# Altium project SC944D.PrjPCB (part 4 of 4)

## Sheet SDEC944-xD_Fil_Pilote_1-2_(commun).SchDoc: Fil Pilote (1/2)
size 393 x 270 mm; CompanyName: Seccom; Address1: 521, rue du capt. François Garbit; Address2: 69440 Mornant; Address3: seccom@seccom.fr; Address4: www.seccom.fr; DocumentNumber: 14; SheetNumber: 14; SheetTotal: 22; PageSetup: Record=PageOptions|CenterHorizontal=True|CenterVertical=True|PrintScale=0.72|XCorrection=1.00|YCorrection=1.00|PrintKind=0|BorderSize=5000000|LeftOffset=0|BottomOffset=0|Orientation=2|PaperLength=1000|PaperWidth=1000|Scale=100|PaperSource=7|PrintQuality=-4|MediaType=1|DitherType=10|PaperKind=A4|PrintScaleMode=1
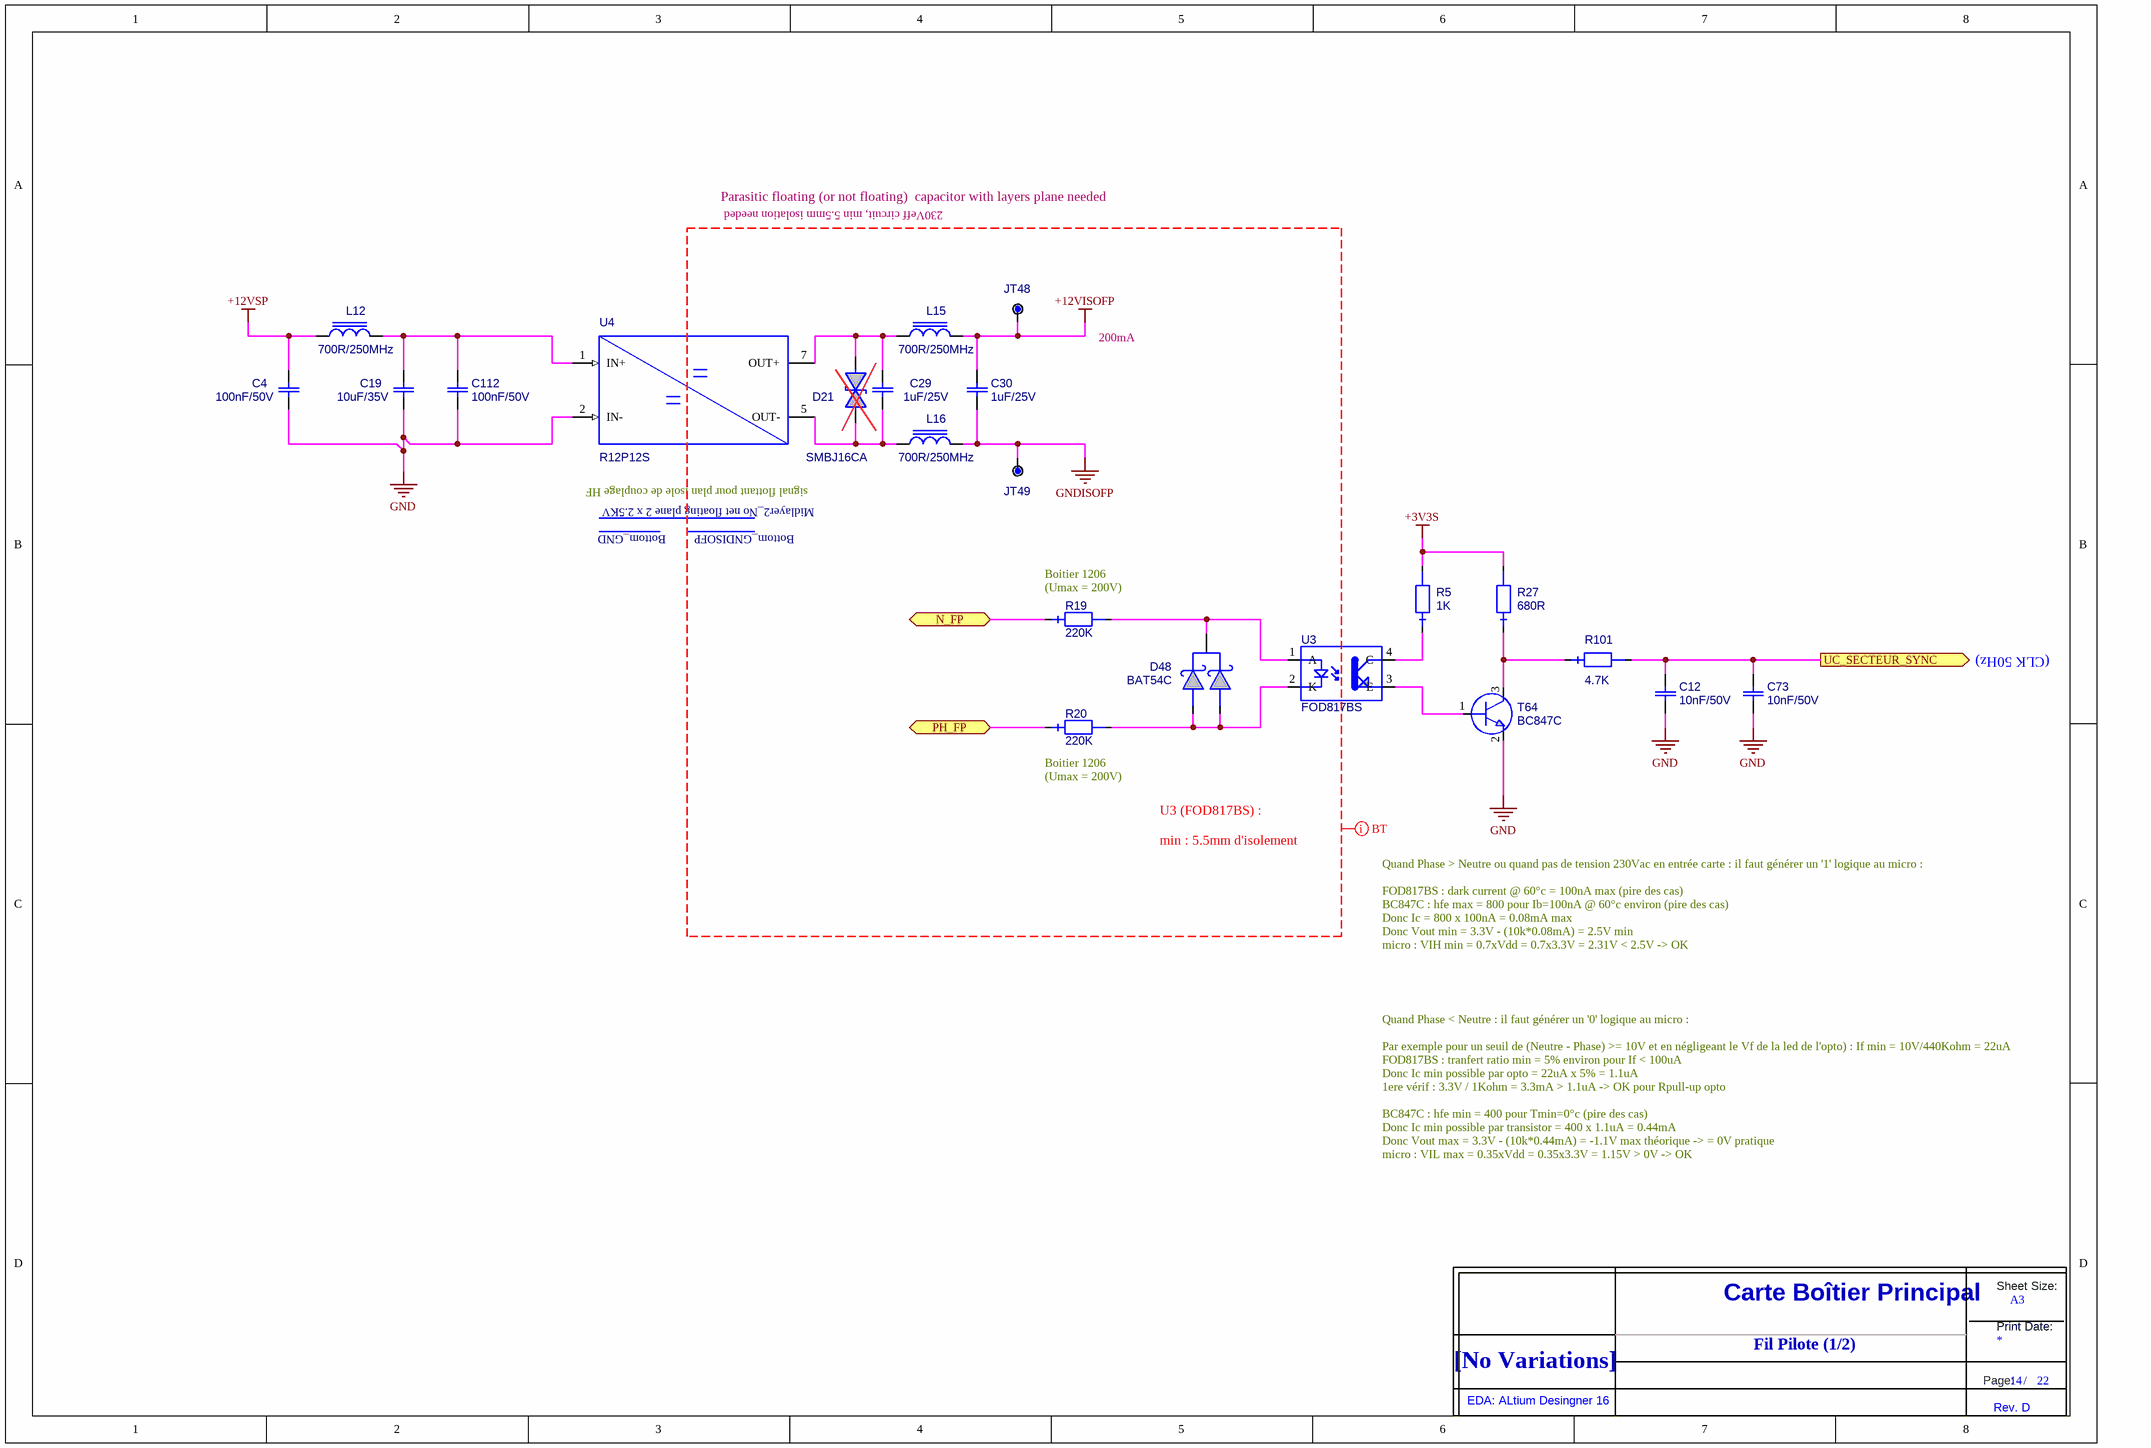
[diagram p8: SDEC944-xD_Fil_Pilote_1-2_(commun).SchDoc]

### Parts
(Parts that share a designator on the sheet are numbered #1, #2 ... from top to bottom, then left to right.)
C4  value 100nF/50V  [0603_ReflowSoldering_CAP]  (hidden comment: C_0603_X7R_10%_100N-50V)
C12  value 10nF/50V  [0603_ReflowSoldering_CAP]  (hidden comment: C_0603_X7R_10%_10N-50V)
C19  value 10uF/35V  [1210_ReflowSoldering_CAP]  (hidden comment: C_1210_X5R_10%_10U-35V)
C29  value 1uF/25V  [0805_ReflowSoldering_CAP]  (hidden comment: C_0805_X5R_10%_1U-25V)
C30  value 1uF/25V  [0805_ReflowSoldering_CAP]  (hidden comment: C_0805_X5R_10%_1U-25V)
C73  value 10nF/50V  [0603_ReflowSoldering_CAP]  (hidden comment: C_0603_X7R_10%_10N-50V)
C112  value 100nF/50V  [0603_ReflowSoldering_CAP]  (hidden comment: C_0603_X7R_10%_100N-50V)
D21  SMBJ16CA  [DO214AA-SMB-NP_ReflowSoldering]  (no BOM)
D48  BAT54C  [SOT23_3L_ReflowSoldering]
JT48  POINT_TEST_PAD_40MIL  [PAD_CL5_E40X40Y17D]  (value not drawn)  (no BOM)
JT49  POINT_TEST_PAD_40MIL  [PAD_CL5_E40X40Y17D]  (value not drawn)  (no BOM)
L12  value 700R/250MHz  [0603_ReflowSoldering_CAP]  (hidden comment: IND_FERRITE_0603_742792643)
L15  value 700R/250MHz  [0603_ReflowSoldering_CAP]  (hidden comment: IND_FERRITE_0603_742792643)
L16  value 700R/250MHz  [0603_ReflowSoldering_CAP]  (hidden comment: IND_FERRITE_0603_742792643)
R5  value 1K  [0603_ReflowSoldering_RES]  (hidden comment: RES_0603_1%_100PPM_1K)
R19  value 220K  [1206_ReflowSoldering_RES]  (hidden comment: RES_1206_1%_100PPM_220K)
R20  value 220K  [1206_ReflowSoldering_RES]  (hidden comment: RES_1206_1%_100PPM_220K)
R27  value 680R  [0603_ReflowSoldering_RES]  (hidden comment: RES_0603_1%_100PPM_680R)
R101  value 4.7K  [0603_ReflowSoldering_RES]  (hidden comment: RES_0603_1%_100PPM_4.7K)
T64  BC847C  [SOT23_3L_ReflowSoldering]
Title_new#9  DNI  (value not drawn)  (graphical)
U3  value FOD817BS  [OPTO_FOD817BS_ReflowSoldering]  (hidden comment: OPTO_FOD817BS)
U4  value R12P12S  [DCDC_SIP_1W_19.5x9.8_h12.5_R12P12S]  (hidden comment: DCDC_+12V_1W_R12P12S)

### Ports
N_FP, PH_FP, UC_SECTEUR_SYNC (out)

### Nets
+3V3S: R5.2 R27.2
+12VISOFP: C30.2 JT48.1 L15.2 R20.1 ; port PH_FP
+12VSP: C4.1 L12.1
GND: C4.2 C12.1 C19.1 C73.1 C112.2 T64.2(E) U4.2(IN-)
GNDISOFP: C30.1 JT49.1 L16.2
N_FP: R19.1 ; port N_FP
UC_SECTEUR_SYNC: C12.2 C73.2 R101.2 ; port UC_SECTEUR_SYNC
NetC19_2: C19.2 C112.1 L12.2 U4.1(IN+)
NetC29_1: C29.1 D21.2 L16.1 U4.5(OUT-)
NetC29_2: C29.2 D21.1 L15.1 U4.7(OUT+)
NetD48_1: D48.1 D48.2 R20.2 U3.2(K)
NetD48_3: D48.3 R19.2 U3.1(A)
NetR5_1: R5.1 U3.4(C)
NetR27_1: R27.1 R101.1 T64.3(C)
NetT64_1: T64.1(B) U3.3(E)

### Layout directives
net class BT: +12VISOFP, GNDISOFP

### Notes on the sheet
- Parasitic floating (or not floating)  capacitor with layers plane needed
- 230Veff circuit, min 5.5mm isolation needed
- 200mA
- Bottom_GND
- Bottom_GNDISOFP
- signal flottant pour plan isole de couplage HF
- Midlayer2_No net floating plane 2 x 2.5KV
- (near R19) Boitier 1206
  (Umax = 200V)
- (CLK 50Hz)
- (near R20) Boitier 1206
  (Umax = 200V)
- U3 (FOD817BS) :
  min : 5.5mm d'isolement
- Quand Phase > Neutre ou quand pas de tension 230Vac en entrée carte : il faut générer un '1' logique au micro :
  FOD817BS : dark current @ 60°c = 100nA max (pire des cas)
  BC847C : hfe max = 800 pour Ib=100nA @ 60°c environ (pire des cas)
  Donc Ic = 800 x 100nA = 0.08mA max
  Donc Vout min = 3.3V - (10k*0.08mA) = 2.5V min
  micro : VIH min = 0.7xVdd = 0.7x3.3V = 2.31V < 2.5V -> OK
- Quand Phase < Neutre : il faut générer un '0' logique au micro :
  Par exemple pour un seuil de (Neutre - Phase) >= 10V et en négligeant le Vf de la led de l'opto) : If min = 10V/440Kohm = 22uA
  FOD817BS : tranfert ratio min = 5% environ pour If < 100uA
  Donc Ic min possible par opto = 22uA x 5% = 1.1uA
  1ere vérif : 3.3V / 1Kohm = 3.3mA > 1.1uA -> OK pour Rpull-up opto
  BC847C : hfe min = 400 pour Tmin=0°c (pire des cas)
  Donc Ic min possible par transistor = 400 x 1.1uA = 0.44mA
  Donc Vout max = 3.3V - (10k*0.44mA) = -1.1V max théorique -> = 0V pratique
  micro : VIL max = 0.35xVdd = 0.35x3.3V = 1.15V > 0V -> OK
- Fil Pilote (1/2)
- (in symbol Title_new) Sheet Size:; Carte Boîtier Principal; A3; Print Date:; [No Variations]; Page:; /; EDA: ALtium Desingner 16; Rev. D

### Library data of the parts
C4 C112 = C_0603_X7R_10%_100N-50V: Condensateur céramique, X7R, 10%, CMS 0603, 100nF/50V; Creation: FB (29/02/12); Boitier: 0603; Remarque: {Remarque}; Fabricant: Kemet; Ref Fab: C0603C104K5RAC; Coeff: 1; ComponentLink1URL: O:\_Documentation\Datasheets\Kemet\Condos_Ceramic_CMS.pdf; ComponentLink2URL: o:\_Documentation\Datasheets\_BOITIERS\PASSIF_CMS\; Config: *; ComponentLink1Description: Datasheet; ComponentLink2Description: Datasheet Boitier; Supplier 1: Farnell; Supplier Part Number 1: 1288255
C12 C73 = C_0603_X7R_10%_10N-50V: Condensateur céramique, X7R, 10%, CMS 0603; Creation: CHD; Boitier: 0603; Remarque: {Remarque}; Coeff: 1; Fabricant: Kemet; Ref Fab: C0603C103K5RAC; ComponentLink1URL: o:\_Documentation\Datasheets\Kemet\Condos_Ceramic_CMS.pdf; ComponentLink2URL: o:\_Documentation\Datasheets\_BOITIERS\PASSIF_CMS\; Config: *; ComponentLink1Description: Datasheet; ComponentLink2Description: Datasheet Boitier; Supplier 1: Farnell; Supplier Part Number 1: 1414609
C19 = C_1210_X5R_10%_10U-35V: Condensateur céramique, X5R, 10%, CMS 1210; Creation: LJ (09/02/09); Reference: 000265/00; Boitier: 1210; Remarque: {Remarque}; Coeff: 1; Fabricant: Taiyo Yuden; Ref Fab: GMK325BJ106KN-T; Verification: *; ComponentLink1URL: o:\_Documentation\Datasheets\TaiyoYuden\High_Value_Multilayer_Ceramic_Caps.pdf; ComponentLink2URL: o:\_Documentation\Datasheets\_Boitiers\PASSIF_CMS\C_1210_(3,2x2,5)_(Schneider).pdf; Config: *; ComponentLink1Description: Datasheet; ComponentLink2Description: Datasheet Boitier
C29 C30 = C_0805_X5R_10%_1U-25V: Condensateur céramique, X5R, 10%, CMS 0805; Creation: FB (07/03/12); Reference: 001834/00; Boitier: 0805; Remarque: {Remarque}; Coeff: 1; Fabricant: AVX; Ref Fab: 08053D105KAT2A; Verification: *; ComponentLink1URL: O:\_Documentation\Datasheets\AVX\Condensateurs_CMS_Ceramic_X5R.pdf; ComponentLink2URL: o:\_Documentation\Datasheets\_Boitiers\PASSIF_CMS\RC_0805_(2x1,25)_(Schneider).pdf; Config: *; ComponentLink1Description: Datasheet; ComponentLink2Description: Datasheet Boitier; Supplier Part Number 1: 1327695; Supplier Part Number 2: 6983409; Supplier 1: Farnell; Supplier 2: Radiospares
D21 = SMBJ16CA: Diode Transil/TVS bidirectionnelle (CA), 600W, 16V, CMS, serie SMBJ; Creation: FB (30/07/13); Boitier: DO214AA/SMB; Remarque: {Remarque}; Coeff: 1; Fabricant: Bourns; ComponentLink1URL: O:\_Documentation\Datasheets\Bourns\SMBJ_diodes_TVS_600W.pdf; ComponentLink2URL: o:\_Documentation\Datasheets\_BOITIERS\ACTIF_CMS\SMx\SMB_(Schneider).lnk; Config: *; ComponentLink1Description: Datasheet; ComponentLink2Description: Datasheet Boitier; Ref Fab: SMBJ16CA; Supplier Part Number 1: 652-SMBJ16CA; Supplier 1: Mouser; Value: SMBJ16CA
D48 = BAT54C: Diode Schottky double, BAT54 cathode com, Vrrm=30V, If=300mA, Vf=0.4Vmax, CMS; Creation: LJ (14/05/02); Reference: 000597/00; Boitier: SOT23_3L; Remarque: {Remarque}; Coeff: 1; Fabricant: NXP; Verification: LJ (14/05/02); ComponentLink1URL: O:\_Documentation\Datasheets\NXP\BAT54_series.pdf; ComponentLink2URL: o:\_Documentation\Datasheets\_BOITIERS\ACTIF_CMS\SOT\SOT_23_3P_(Schneider).PDF; Config: *; ComponentLink1Description: Datasheet; ComponentLink2Description: Datasheet Boitier; Ref Fab: BAT54C; Supplier 1: Farnell; Supplier Part Number 1: 1081192; Value: BAT54C
JT48 JT49 = POINT_TEST_PAD_40MIL: Point de test sur CI, pad de diamètre 1.016mm (40mils); Creation: FB (04/10/12); Remarque: {Remarque}; Coeff: 1; Value: POINT_TEST; Config: *; ComponentLink1Description: Datasheet; ComponentLink2Description: Datasheet Boitier
L12 L15 L16 = IND_FERRITE_0603_742792643: Inductance à ferrite multicouches CMS, imp=700R@250MHz, +/-25%, Rdc=350mR, I=400mA; Creation: PDP (02/08/12); Boitier: 0603; Coeff: 1; Fabricant: Wurth Elektronik; ComponentLink1URL: o:\_Documentation\Datasheets\Murata\Ferrite_BLM21P.pdf; Config: *; ComponentLink1Description: Datasheet; ComponentLink2Description: Datasheet Boitier; Ref Fab: 742792643; Supplier 1: Farnell; Supplier Part Number 1: 1800349
R5 = RES_0603_1%_100PPM_1K: Résistance, 0.100W, 1%, 100ppm, 75V, 1K; Creation: JPL (05/07/12); Boitier: 0603; Remarque: {Remarque}; Fabricant: Vishay; Ref Fab: CRCW06031K00FKEA; Coeff: 1; Verification: *; ComponentLink1URL: O:\_Documentation\Datasheets\Vishay\Resistances_D-CRCWe3.pdf; ComponentLink2URL: o:\_Documentation\Datasheets\_BOITIERS\PASSIF_CMS\; Config: *; ComponentLink1Description: Datasheet; ComponentLink2Description: Datasheet Boitier; Supplier 1: Farnell; Supplier 2: RadioSpares; Supplier Part Number 1: 1469740; Supplier Part Number 2: 6789875
R19 R20 = RES_1206_1%_100PPM_220K: Résistance, 0.25W, 1%, 100ppm, 200V, 220K; Creation: PDP (29/09/12); Boitier: 1206; Remarque: {Remarque}; Fabricant: Vishay; Ref Fab: CRCW1206220KFKEA; Coeff: 1; Verification: *; ComponentLink1URL: O:\_Documentation\Datasheets\Vishay\Resistances_D-CRCWe3.pdf; ComponentLink2URL: o:\_Documentation\Datasheets\_BOITIERS\PASSIF_CMS\; Config: *; ComponentLink1Description: Datasheet; ComponentLink2Description: Datasheet Boitier; Supplier 1: Mouser; Supplier Part Number 1: 71-CRCW1206-220K-E3; Supplier 2: Farnell; Supplier Part Number 2: 1152834
R27 = RES_0603_1%_100PPM_680R: Résistance, 0.100W, 1%, 100ppm, 75V, 680R; Creation: FB (02/08/12); Boitier: 0603; Remarque: {Remarque}; Fabricant: Vishay; Ref Fab: CRCW0603680RFKEA; Coeff: 1; Verification: *; ComponentLink1URL: O:\_Documentation\Datasheets\Vishay\Resistances_D-CRCWe3.pdf; ComponentLink2URL: o:\_Documentation\Datasheets\_BOITIERS\PASSIF_CMS\; Config: *; ComponentLink1Description: Datasheet; ComponentLink2Description: Datasheet Boitier; Supplier 1: Farnell; Supplier Part Number 1: 1469834; Supplier 2: Mouser; Supplier Part Number 2: 71-CRCW0603-680-E3
R101 = RES_0603_1%_100PPM_4.7K: Résistance, 0.100W, 1%, 100ppm, 75V, 4.7K; Creation: JPL (05/07/12); Boitier: 0603; Remarque: {Remarque}; Fabricant: Vishay; Ref Fab: CRCW06034K70FKEA; Coeff: 1; Verification: *; ComponentLink1URL: O:\_Documentation\Datasheets\Vishay\Resistances_D-CRCWe3.pdf; ComponentLink2URL: o:\_Documentation\Datasheets\_BOITIERS\PASSIF_CMS\; Config: *; ComponentLink1Description: Datasheet; ComponentLink2Description: Datasheet Boitier; Supplier 1: Farnell; Supplier 2: RadioSpares; Supplier Part Number 1: 1469807; Supplier Part Number 2: 6790484
T64 = BC847C: Transistor NPN, Vce=50V, Ic=0.1A, hfe=420~800, 0.25W, CMS; Creation: GO (08/07/05); Verification: LJ (21/07/05); Reference: 000329/00; Boitier: SOT23_3L; Remarque: Complementaires aux BC856-860; Fabricant: NXP; Coeff: 1; Ref Fab: BC847C; ComponentLink1URL: O:\_Documentation\Datasheets\NXP\BC847.pdf; ComponentLink2URL: o:\_Documentation\Datasheets\_BOITIERS\ACTIF_CMS\SOT\SOT_23_3P_(Schneider).PDF; Config: *; ComponentLink1Description: Datasheet; Value: BC847C; Supplier 1: Farnell; Supplier Part Number 1: 1081235; ComponentLink2Description: Datasheet Boitier
Title_new#9 = Title_new
U3 = OPTO_FOD817BS: Optocouleur simple, IR GaAs, Viso=5kVrms, If=50mA, Vce=70V, Ic=50mA, CTR=130-260, CMS; Creation: FB (10/07/12); Boitier: MDIP4-SM; Remarque: {Remarque}; Coeff: 1; Fabricant: Fairchild; Verification: *; ComponentLink1URL: O:\_Documentation\Datasheets\Fairchild\FOD814A.pdf; ComponentLink2URL: o:\_Documentation\Datasheets\; Config: *; ComponentLink1Description: Datasheet; ComponentLink2Description: Datasheet Boitier; Ref Fab: FOD817BS; Supplier Part Number 1: 512-FOD817BS; Supplier 1: Mouser
U4 = DCDC_+12V_1W_R12P12S: Convertisseur DC/DC, 1W, Vin=12V, Vout=+12V/84mA, boitier SIP4, isol 6.4kV; Creation: LJ (11/06/12); Boitier: DCDC_SIP_19.5x9.8_h12.5mm; Coeff: 1; Fabricant: Recom; Verification: *; ComponentLink1URL: o:\_Documentation\Datasheets\Recom\Convertisseur_DCDC_RxxPxx.pdf; ComponentLink2URL: o:\_Documentation\Datasheets\_BOITIERS\; ComponentLink1Description: Datasheet; ComponentLink2Description: Datasheet Boitier; Ref Fab: R12P12S; Supplier 1: Mouser; Supplier Part Number 1: 919-R12P12S

## Sheet SDEC944-xD_Fil_Pilote_2-2_(zone_jour).SchDoc: Fil Pilote (2/2)
size 393 x 270 mm; CompanyName: Seccom; Address1: 521, rue du capt. François Garbit; Address2: 69440 Mornant; Address3: seccom@seccom.fr; Address4: www.seccom.fr; DocumentNumber: 15; SheetNumber: 15; SheetTotal: 22; PageSetup: Record=PageOptions|CenterHorizontal=True|CenterVertical=True|PrintScale=0.74|XCorrection=1.00|YCorrection=1.00|PrintKind=0|BorderSize=5000000|LeftOffset=0|BottomOffset=0|Orientation=2|PaperLength=1000|PaperWidth=1000|Scale=100|PaperSource=7|PrintQuality=-4|MediaType=1|DitherType=10|PaperKind=A4|PrintScaleMode=1
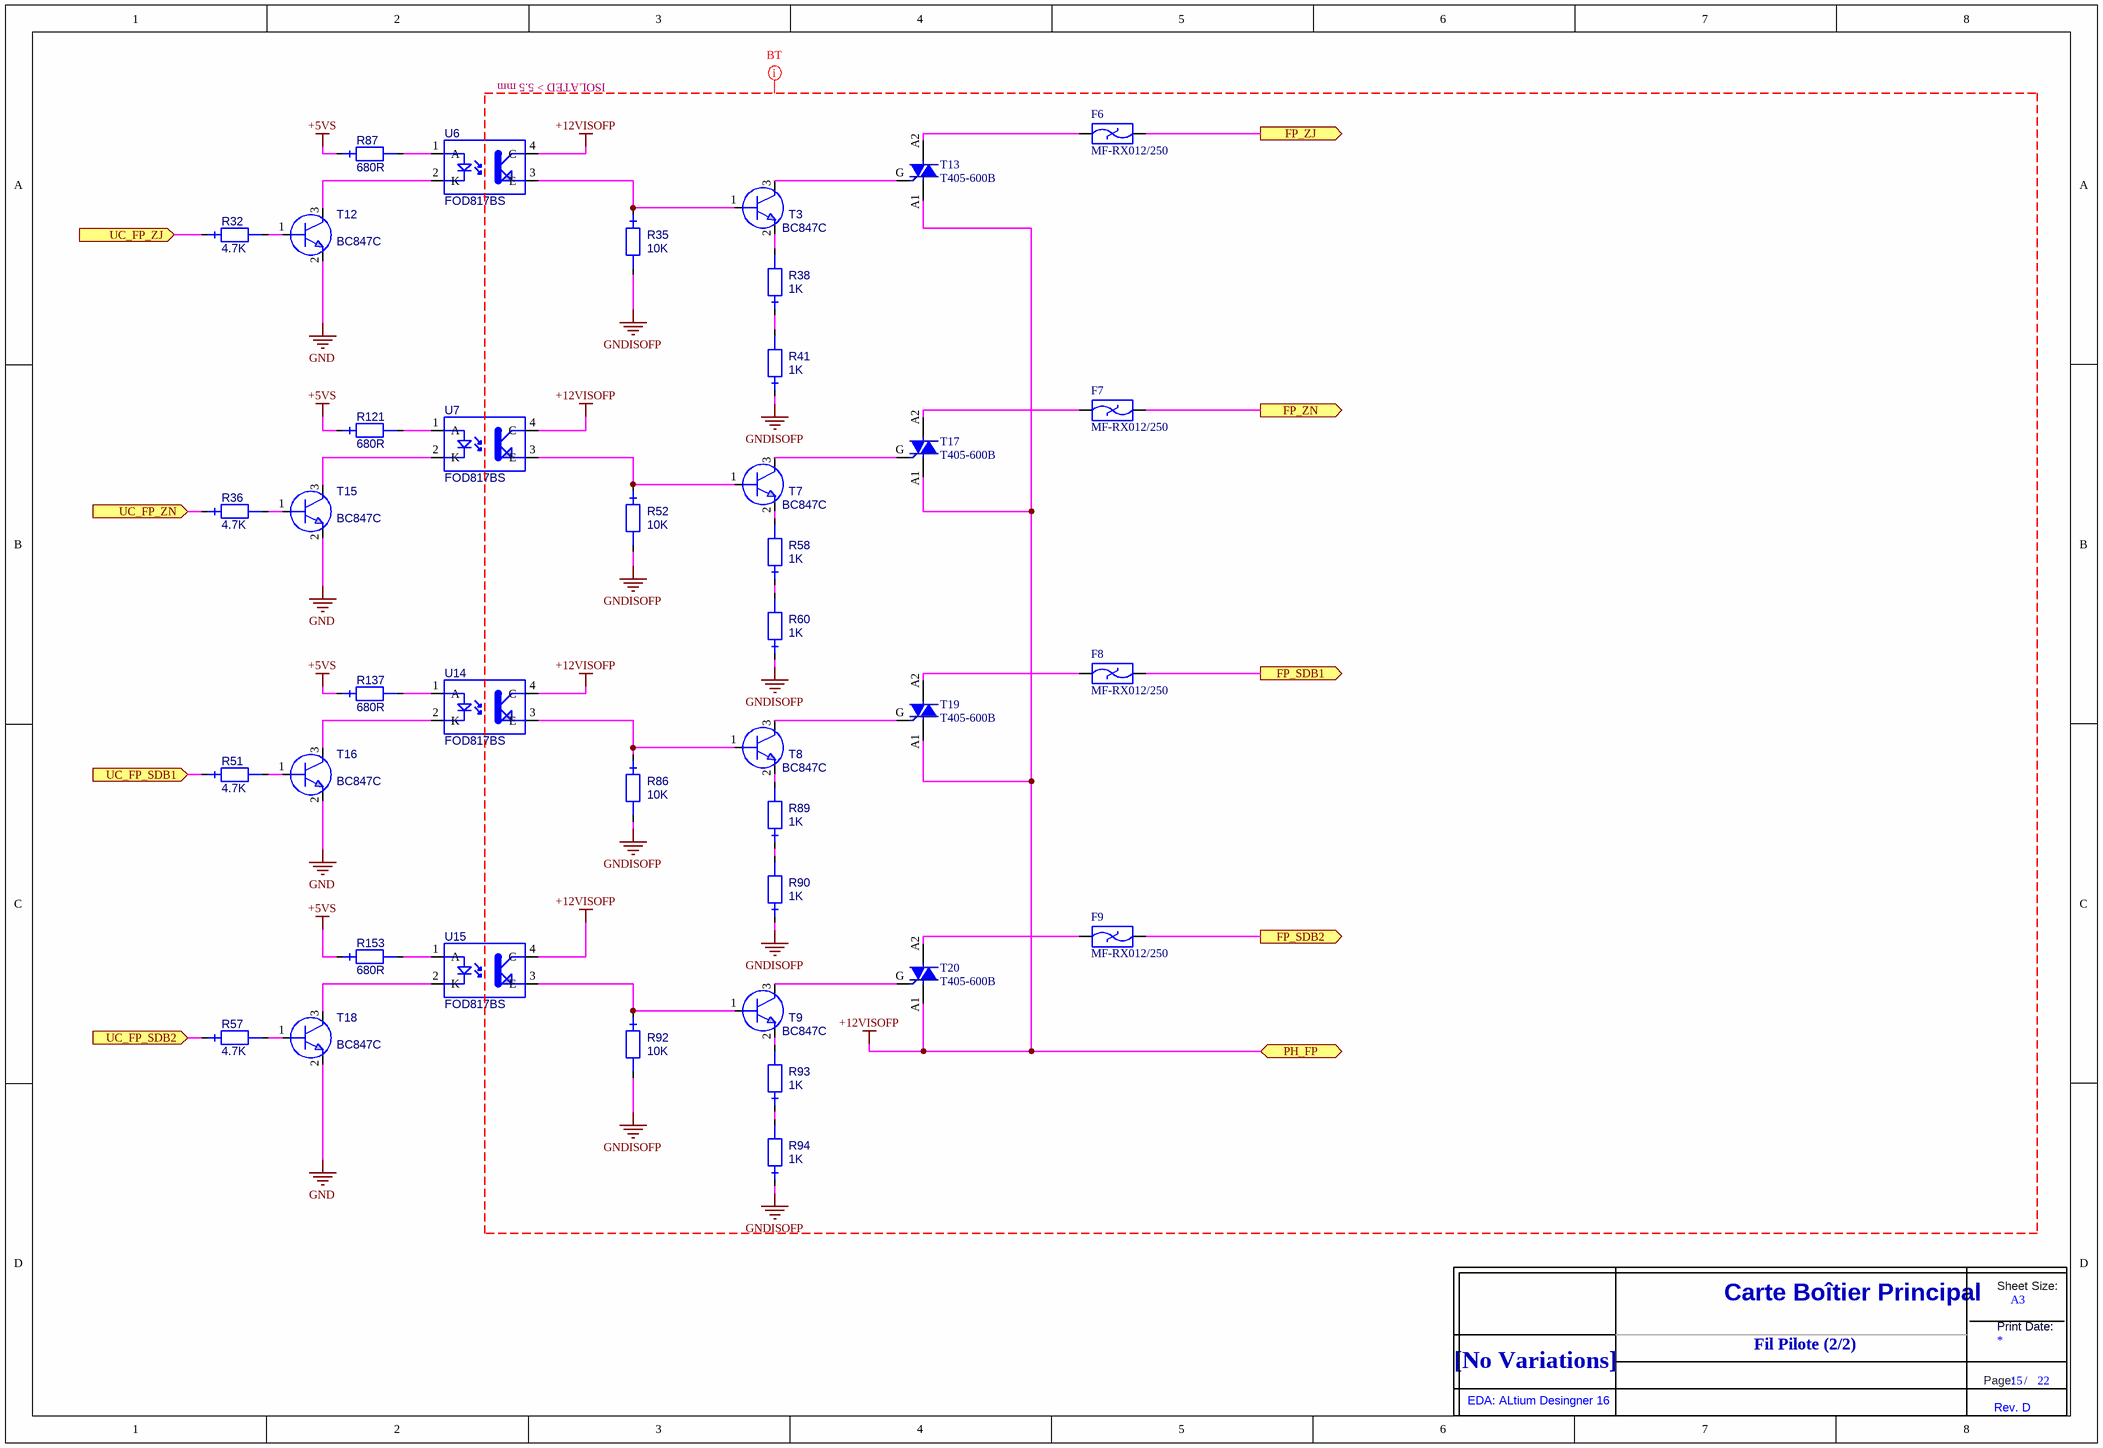
[diagram p9: SDEC944-xD_Fil_Pilote_2-2_(zone_jour).SchDoc]

### Parts
(Parts that share a designator on the sheet are numbered #1, #2 ... from top to bottom, then left to right.)
F6  MF-RX012/250  [MF-RX012-250-0]
F7  MF-RX012/250  [MF-RX012-250-0]
F8  MF-RX012/250  [MF-RX012-250-0]
F9  MF-RX012/250  [MF-RX012-250-0]
R32  value 4.7K  [0603_ReflowSoldering_RES]  (hidden comment: RES_0603_1%_100PPM_4.7K)
R35  value 10K  [0603_ReflowSoldering_RES]  (hidden comment: RES_0603_1%_100PPM_10K)
R36  value 4.7K  [0603_ReflowSoldering_RES]  (hidden comment: RES_0603_1%_100PPM_4.7K)
R38  value 1K  [0603_ReflowSoldering_RES]  (hidden comment: RES_0603_1%_100PPM_1K)
R41  value 1K  [0603_ReflowSoldering_RES]  (hidden comment: RES_0603_1%_100PPM_1K)
R51  value 4.7K  [0603_ReflowSoldering_RES]  (hidden comment: RES_0603_1%_100PPM_4.7K)
R52  value 10K  [0603_ReflowSoldering_RES]  (hidden comment: RES_0603_1%_100PPM_10K)
R57  value 4.7K  [0603_ReflowSoldering_RES]  (hidden comment: RES_0603_1%_100PPM_4.7K)
R58  value 1K  [0603_ReflowSoldering_RES]  (hidden comment: RES_0603_1%_100PPM_1K)
R60  value 1K  [0603_ReflowSoldering_RES]  (hidden comment: RES_0603_1%_100PPM_1K)
R86  value 10K  [0603_ReflowSoldering_RES]  (hidden comment: RES_0603_1%_100PPM_10K)
R87  value 680R  [0603_ReflowSoldering_RES]  (hidden comment: RES_0603_1%_100PPM_680R)
R89  value 1K  [0603_ReflowSoldering_RES]  (hidden comment: RES_0603_1%_100PPM_1K)
R90  value 1K  [0603_ReflowSoldering_RES]  (hidden comment: RES_0603_1%_100PPM_1K)
R92  value 10K  [0603_ReflowSoldering_RES]  (hidden comment: RES_0603_1%_100PPM_10K)
R93  value 1K  [0603_ReflowSoldering_RES]  (hidden comment: RES_0603_1%_100PPM_1K)
R94  value 1K  [0603_ReflowSoldering_RES]  (hidden comment: RES_0603_1%_100PPM_1K)
R121  value 680R  [0603_ReflowSoldering_RES]  (hidden comment: RES_0603_1%_100PPM_680R)
R137  value 680R  [0603_ReflowSoldering_RES]  (hidden comment: RES_0603_1%_100PPM_680R)
R153  value 680R  [0603_ReflowSoldering_RES]  (hidden comment: RES_0603_1%_100PPM_680R)
T3  BC847C  [SOT23_3L_ReflowSoldering]
T7  BC847C  [SOT23_3L_ReflowSoldering]
T8  BC847C  [SOT23_3L_ReflowSoldering]
T9  BC847C  [SOT23_3L_ReflowSoldering]
T12  BC847C  [SOT23_3L_ReflowSoldering]
T13  T405-600B  [DPAK]
T15  BC847C  [SOT23_3L_ReflowSoldering]
T16  BC847C  [SOT23_3L_ReflowSoldering]
T17  T405-600B  [DPAK]
T18  BC847C  [SOT23_3L_ReflowSoldering]
T19  T405-600B  [DPAK]
T20  T405-600B  [DPAK]
Title_new#10  DNI  (value not drawn)  (graphical)
U6  value FOD817BS  [OPTO_FOD817BS_ReflowSoldering]  (hidden comment: OPTO_FOD817BS)
U7  value FOD817BS  [OPTO_FOD817BS_ReflowSoldering]  (hidden comment: OPTO_FOD817BS)
U14  value FOD817BS  [OPTO_FOD817BS_ReflowSoldering]  (hidden comment: OPTO_FOD817BS)
U15  value FOD817BS  [OPTO_FOD817BS_ReflowSoldering]  (hidden comment: OPTO_FOD817BS)

### Ports
FP_SDB1 (out), FP_SDB2 (out), FP_ZJ (out), FP_ZN (out), PH_FP, UC_FP_SDB1 (in), UC_FP_SDB2 (in), UC_FP_ZJ (in), UC_FP_ZN (in)

### Nets
+5VS: R87.1 R121.1 R137.1 R153.1
+12VISOFP: T13.A1 T17.A1 T19.A1 T20.A1 U6.4(C) U7.4(C) U14.4(C) U15.4(C) ; port PH_FP
GND: T12.2(E) T15.2(E) T16.2(E) T18.2(E)
GNDISOFP: R35.2 R41.1 R52.2 R60.1 R86.2 R90.1 R92.2 R94.1
FP_SDB1: F8.2 ; port FP_SDB1
FP_SDB2: F9.2 ; port FP_SDB2
FP_ZJ: F6.2 ; port FP_ZJ
FP_ZN: F7.2 ; port FP_ZN
UC_FP_SDB1: R51.1 ; port UC_FP_SDB1
UC_FP_SDB2: R57.1 ; port UC_FP_SDB2
UC_FP_ZJ: R32.1 ; port UC_FP_ZJ
UC_FP_ZN: R36.1 ; port UC_FP_ZN
NetF6_1: F6.1 T13.A2
NetF7_1: F7.1 T17.A2
NetF8_1: F8.1 T19.A2
NetF9_1: F9.1 T20.A2
NetR32_2: R32.2 T12.1(B)
NetR35_1: R35.1 T3.1(B) U6.3(E)
NetR36_2: R36.2 T15.1(B)
NetR38_1: R38.1 R41.2
NetR38_2: R38.2 T3.2(E)
NetR51_2: R51.2 T16.1(B)
NetR52_1: R52.1 T7.1(B) U7.3(E)
NetR57_2: R57.2 T18.1(B)
NetR58_1: R58.1 R60.2
NetR58_2: R58.2 T7.2(E)
NetR86_1: R86.1 T8.1(B) U14.3(E)
NetR87_2: R87.2 U6.1(A)
NetR89_1: R89.1 R90.2
NetR89_2: R89.2 T8.2(E)
NetR92_1: R92.1 T9.1(B) U15.3(E)
NetR93_1: R93.1 R94.2
NetR93_2: R93.2 T9.2(E)
NetR121_2: R121.2 U7.1(A)
NetR137_2: R137.2 U14.1(A)
NetR153_2: R153.2 U15.1(A)
NetT3_3: T3.3(C) T13.G
NetT7_3: T7.3(C) T17.G
NetT8_3: T8.3(C) T19.G
NetT9_3: T9.3(C) T20.G
NetT12_3: T12.3(C) U6.2(K)
NetT15_3: T15.3(C) U7.2(K)
NetT16_3: T16.3(C) U14.2(K)
NetT18_3: T18.3(C) U15.2(K)

### Layout directives
net class BT: +12VISOFP, GNDISOFP

### Notes on the sheet
- ISOLATED > 5.5 mm
- Fil Pilote (2/2)
- (in symbol Title_new) Sheet Size:; Carte Boîtier Principal; A3; Print Date:; [No Variations]; Page:; /; EDA: ALtium Desingner 16; Rev. D

### Library data of the parts
F6-F9 = MF-RX012/250-0: Resettable Fuses - PPTC 0.12A 60V 4ohm Hold .12 Trip .16; Fabricant: Bourns Inc.; Ref Fab: MF-RX012/250-2; Value: MF-RX012/250-2; Supplier 1: Digi-Key; Supplier Part Number 1: MF-RX012/250-0-ND
R32 R36 R51 R57 = RES_0603_1%_100PPM_4.7K: as R101 on sheet SDEC944-xD_Fil_Pilote_1-2_(commun); Verification: *; ComponentLink1URL: O:\_Documentation\Datasheets\Vishay\Resistances_D-CRCWe3.pdf; ComponentLink2URL: o:\_Documentation\Datasheets\_BOITIERS\PASSIF_CMS\; Config: *; ComponentLink1Description: Datasheet; ComponentLink2Description: Datasheet Boitier; Supplier 1: Farnell; Supplier 2: RadioSpares; Supplier Part Number 1: 1469807; Supplier Part Number 2: 6790484
R35 R52 R86 R92 = RES_0603_1%_100PPM_10K: Résistance, 0.100W, 1%, 100ppm, 75V, 10K; Creation: JPL (05/07/12); Boitier: 0603; Remarque: {Remarque}; Fabricant: Vishay; Ref Fab: CRCW060310K0FKEA; Coeff: 1; Verification: *; ComponentLink1URL: O:\_Documentation\Datasheets\Vishay\Resistances_D-CRCWe3.pdf; ComponentLink2URL: o:\_Documentation\Datasheets\_BOITIERS\PASSIF_CMS\; Config: *; ComponentLink1Description: Datasheet; ComponentLink2Description: Datasheet Boitier; Supplier 1: Farnell; Supplier 2: RadioSpares; Supplier Part Number 1: 1469748; Supplier Part Number 2: 6789667
R38 R41 R58 R60 R89 R90 R93 R94 = RES_0603_1%_100PPM_1K: as R5 on sheet SDEC944-xD_Fil_Pilote_1-2_(commun); Verification: *; ComponentLink1URL: O:\_Documentation\Datasheets\Vishay\Resistances_D-CRCWe3.pdf; ComponentLink2URL: o:\_Documentation\Datasheets\_BOITIERS\PASSIF_CMS\; Config: *; ComponentLink1Description: Datasheet; ComponentLink2Description: Datasheet Boitier; Supplier 1: Farnell; Supplier 2: RadioSpares; Supplier Part Number 1: 1469740; Supplier Part Number 2: 6789875
R87 R121 R137 R153 = RES_0603_1%_100PPM_680R: as R27 on sheet SDEC944-xD_Fil_Pilote_1-2_(commun); Verification: *; ComponentLink1URL: O:\_Documentation\Datasheets\Vishay\Resistances_D-CRCWe3.pdf; ComponentLink2URL: o:\_Documentation\Datasheets\_BOITIERS\PASSIF_CMS\; Config: *; ComponentLink1Description: Datasheet; ComponentLink2Description: Datasheet Boitier; Supplier 1: Farnell; Supplier Part Number 1: 1469834; Supplier 2: Mouser; Supplier Part Number 2: 71-CRCW0603-680-E3
T3 T7-T9 T12 T15 T16 T18 = BC847C: as T64 on sheet SDEC944-xD_Fil_Pilote_1-2_(commun); Ref Fab: BC847C; ComponentLink1URL: O:\_Documentation\Datasheets\NXP\BC847.pdf; ComponentLink2URL: o:\_Documentation\Datasheets\_BOITIERS\ACTIF_CMS\SOT\SOT_23_3P_(Schneider).PDF; Config: *; ComponentLink1Description: Datasheet; Value: BC847C; Supplier 1: Farnell; Supplier Part Number 1: 1081235; ComponentLink2Description: Datasheet Boitier
T13 T17 T19 T20 = T405-600B-TR: TRIAC SENS GATE 600V 4A DPAK; Manufacturer: STMicroelectronics; Triac Type: Logic - Sensitive Gate; Voltage - Gate Trigger (Vgt) (Max): 1.3V; Current - Non Rep. Surge 50, 60Hz (Itsm): 30A, 31A; Current - Gate Trigger (Igt) (Max): 5mA; Current - Hold (Ih) (Max): 10mA; Configuration: Single; Supplier 1: Digi-Key; RoHS: RoHS Compliant; Category: Discrete Semiconductor Products; Stock 1: 12315; Pricing 1: 1=0.97, 10=0.866, 100=0.6755, 500=0.5586, 1000=0.44175 (USD); Packaging: Cut Tape (CT); Part Status: Active; Voltage - Off State: 600V; Current - On State (It (RMS)) (Max): 4A; Operating Temperature: -40°C ~ 150°C (TJ); Mounting Type: Surface Mount; Package / Case: TO-252-3, DPak (2 Leads + Tab), SC-63; Supplier Device Package: D-Pak; ComponentLink1URL: http://www.st.com/content/ccc/resource/technical/document/datasheet/cf/95/c3/9d/a2/b7/47/43/CD00002383.pdf/files/CD00002383.pdf/_jcr_content/translations/en.CD00002383.pdf; ComponentLink1Description: http://www.st.com/content/ccc/resource/technical/document/datasheet/cf/95/c3/9d/a2/b7/47/43/CD00002383.pdf/files/CD00002383.pdf/_jcr_content/translations/en.CD00002383.pdf; Supplier Part Number 1: 497-2505-1-ND; Manufacturer Part Number: T405-600B-TR; Fabricant: STMicroelectronics; Ref Fab: T405-600B-TR; Value: T405-600B
Title_new#10 = Title_new
U6 U7 U14 U15 = OPTO_FOD817BS: as U3 on sheet SDEC944-xD_Fil_Pilote_1-2_(commun); Verification: *; ComponentLink1URL: O:\_Documentation\Datasheets\Fairchild\FOD814A.pdf; ComponentLink2URL: o:\_Documentation\Datasheets\; Config: *; ComponentLink1Description: Datasheet; ComponentLink2Description: Datasheet Boitier; Ref Fab: FOD817BS; Supplier Part Number 1: 512-FOD817BS; Supplier 1: Mouser

## Sheet SDEC944-xD_Machines_laver_2-2_(commande).SchDoc: Machines à laver 2/2 (commande)
size 393 x 270 mm; CompanyName: Seccom; Address1: 521, rue du capt. François Garbit; Address2: 69440 Mornant; Address3: seccom@seccom.fr; Address4: www.seccom.fr; DocumentNumber: 17; SheetNumber: 17; SheetTotal: 22; PageSetup: Record=PageOptions|CenterHorizontal=True|CenterVertical=True|PrintScale=0.74|XCorrection=1.00|YCorrection=1.00|PrintKind=0|BorderSize=5000000|LeftOffset=0|BottomOffset=0|Orientation=2|PaperLength=1000|PaperWidth=1000|Scale=100|PaperSource=7|PrintQuality=-4|MediaType=1|DitherType=10|PaperKind=A4|PrintScaleMode=1
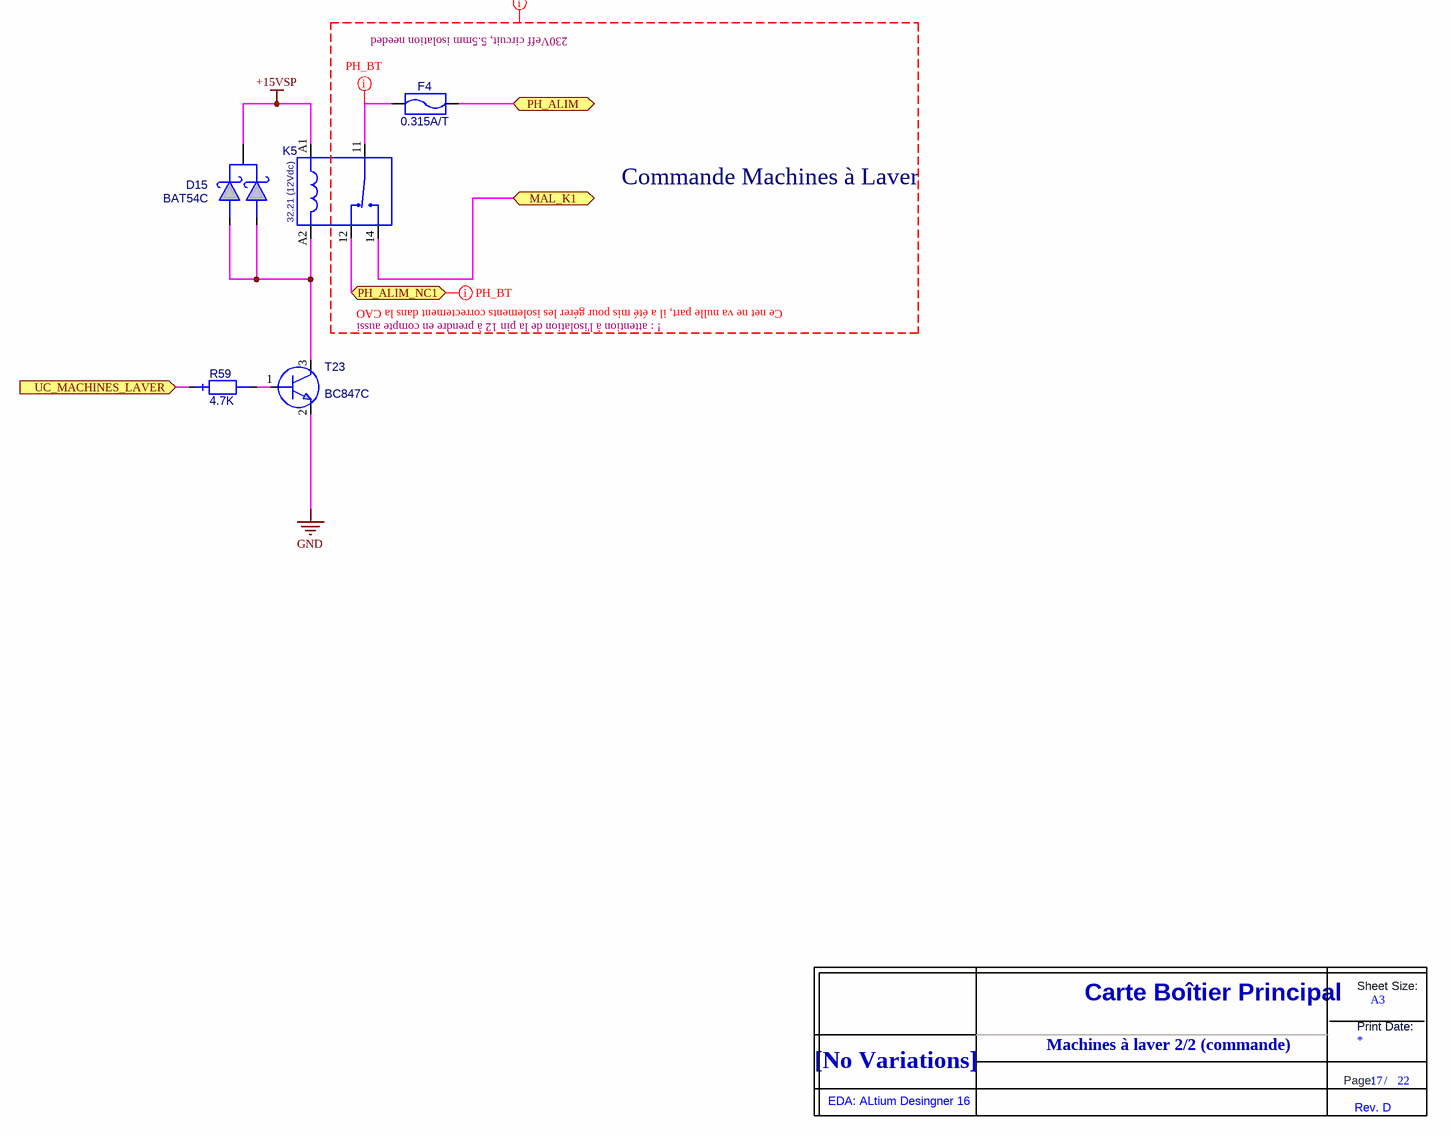
[diagram p10: SDEC944-xD_Machines_laver_2-2_(commande).SchDoc]

### Parts
(Parts that share a designator on the sheet are numbered #1, #2 ... from top to bottom, then left to right.)
D15  BAT54C  [SOT23_3L_ReflowSoldering]
F4  value 0.315A/T  [FUSIBLE_UMT250]  (hidden comment: FUSIBLE_UMT250_0.315A_T)
K5  value 32.21 (12Vdc)  [RELAY_FINDER_32.21]  (hidden comment: RELAY_12VDC_1RT_32.21)
R59  value 4.7K  [0603_ReflowSoldering_RES]  (hidden comment: RES_0603_1%_100PPM_4.7K)
T23  BC847C  [SOT23_3L_ReflowSoldering]
Title_new#11  DNI  (value not drawn)  (graphical)

### Ports
MAL_K1 (bidir), PH_ALIM (bidir), PH_ALIM_NC1 (bidir), UC_MACHINES_LAVER (in)

### Nets
+15VSP: D15.3 K5.A1
GND: T23.2(E)
MAL_K1: K5.14(NO) ; port MAL_K1
PH_ALIM: F4.2 ; port PH_ALIM
PH_ALIM_NC1: K5.12(NC) ; port PH_ALIM_NC1
UC_MACHINES_LAVER: R59.1 ; port UC_MACHINES_LAVER
NetD15_1: D15.1 D15.2 K5.A2 T23.3(C)
NetF4_1: F4.1 K5.11(COM)
NetR59_2: R59.2 T23.1(B)

### Layout directives
net class BT: (no net found under the mark)
net class PH_BT: NetF4_1, PH_ALIM_NC1

### Notes on the sheet
- 230Veff circuit, 5.5mm isolation needed
- Commande Machines à Laver
- ! : attention à l'isolation de la pin 12 à prendre en compte aussi
- Ce net ne va nulle part, il a été mis pour gérer les isolements correctement dans la CAO
- Machines à laver 2/2 (commande)
- (in symbol Title_new) Sheet Size:; Carte Boîtier Principal; A3; Print Date:; [No Variations]; Page:; /; EDA: ALtium Desingner 16; Rev. D

### Library data of the parts
D15 = BAT54C: as D48 on sheet SDEC944-xD_Fil_Pilote_1-2_(commun); Verification: LJ (14/05/02); ComponentLink1URL: O:\_Documentation\Datasheets\NXP\BAT54_series.pdf; ComponentLink2URL: o:\_Documentation\Datasheets\_BOITIERS\ACTIF_CMS\SOT\SOT_23_3P_(Schneider).PDF; Config: *; ComponentLink1Description: Datasheet; ComponentLink2Description: Datasheet Boitier; Ref Fab: BAT54C; Supplier 1: Farnell; Supplier Part Number 1: 1081192; Value: BAT54C
F4 = FUSIBLE_UMT250_0.315A_T: Fusible CMS, série UMT250, à souder sur CI, 250Vca/125Vdc, 0.315A, Temporisé; Creation: PDP (26/09/12); Boitier: UMT250_(10.1x3mm); Remarque: Valeurs: de 80mA à 10A; Coeff: 1; Fabricant: Schurter; Ref Fab: 3403.0161; Config: *; ComponentLink1Description: Datasheet; ComponentLink1URL: O:\_Documentation\Datasheets\Schurter\Fusibles_CMS_UMT_250.pdf; ComponentLink2Description: Datasheet Boitier; ComponentLink2URL: o:\_Documentation\Datasheets\Littelfuse\449.pdf; Supplier 1: Mouser; Supplier Part Number 1: 693-3403.0161.11; Supplier 2: Farnell; Supplier Part Number 2: 1221084
K5 = RELAY_12VDC_1RT_32.21: Relais 1RT, 12Vdc, série 32.21, Rc=720R, Sw:250Vac/6A, Ron=? (AgCdO); Creation: CHD (21/03/12); Boitier: 20x10x10.7mm; Remarque: {Remarque}; Fabricant: Finder; Ref Fab: 32.21.7.012.2000; Coeff: 1; ComponentLink1URL: O:\_Documentation\Datasheets\Finder\Relais_Serie_32.pdf; ComponentLink2URL: o:\_Documentation\Datasheets\Finder\; Config: *; ComponentLink1Description: Datasheet; ComponentLink2Description: Datasheet Boitier; Supplier 1: Farnell; Supplier Part Number 1: 1329652
R59 = RES_0603_1%_100PPM_4.7K: as R101 on sheet SDEC944-xD_Fil_Pilote_1-2_(commun); Verification: *; ComponentLink1URL: O:\_Documentation\Datasheets\Vishay\Resistances_D-CRCWe3.pdf; ComponentLink2URL: o:\_Documentation\Datasheets\_BOITIERS\PASSIF_CMS\; Config: *; ComponentLink1Description: Datasheet; ComponentLink2Description: Datasheet Boitier; Supplier 1: Farnell; Supplier 2: RadioSpares; Supplier Part Number 1: 1469807; Supplier Part Number 2: 6790484
T23 = BC847C: as T64 on sheet SDEC944-xD_Fil_Pilote_1-2_(commun); Ref Fab: BC847C; ComponentLink1URL: O:\_Documentation\Datasheets\NXP\BC847.pdf; ComponentLink2URL: o:\_Documentation\Datasheets\_BOITIERS\ACTIF_CMS\SOT\SOT_23_3P_(Schneider).PDF; Config: *; ComponentLink1Description: Datasheet; Value: BC847C; Supplier 1: Farnell; Supplier Part Number 1: 1081235; ComponentLink2Description: Datasheet Boitier
Title_new#11 = Title_new

## Sheet SDEC944-xD_Cumulus.SchDoc: Cumulus
size 393 x 270 mm; CompanyName: Seccom; Address1: 521, rue du capt. François Garbit; Address2: 69440 Mornant; Address3: seccom@seccom.fr; Address4: www.seccom.fr; DocumentNumber: 18; SheetNumber: 18; SheetTotal: 22; PageSetup: Record=PageOptions|CenterHorizontal=True|CenterVertical=True|PrintScale=0.74|XCorrection=1.00|YCorrection=1.00|PrintKind=0|BorderSize=5000000|LeftOffset=0|BottomOffset=0|Orientation=2|PaperLength=1000|PaperWidth=1000|Scale=100|PaperSource=7|PrintQuality=-4|MediaType=1|DitherType=10|PaperKind=A4|PrintScaleMode=1
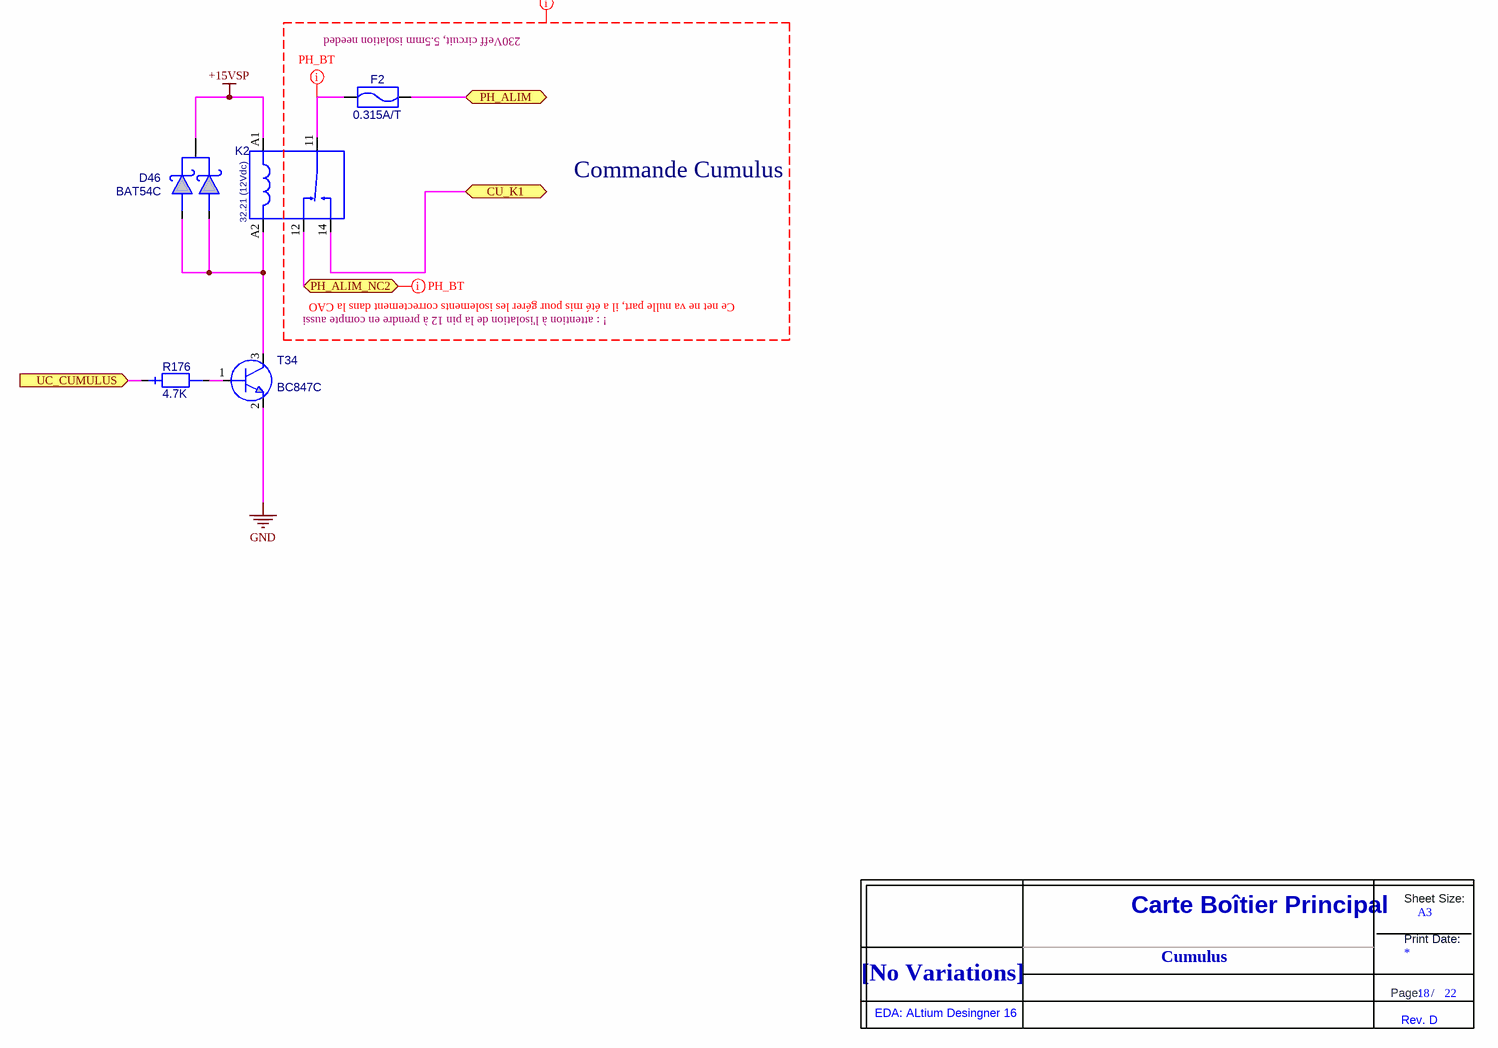
[diagram p11: SDEC944-xD_Cumulus.SchDoc]

### Parts
(Parts that share a designator on the sheet are numbered #1, #2 ... from top to bottom, then left to right.)
D46  BAT54C  [SOT23_3L_ReflowSoldering]
F2  value 0.315A/T  [FUSIBLE_UMT250]  (hidden comment: FUSIBLE_UMT250_0.315A_T)
K2  value 32.21 (12Vdc)  [RELAY_FINDER_32.21]  (hidden comment: RELAY_12VDC_1RT_32.21)
R176  value 4.7K  [0603_ReflowSoldering_RES]  (hidden comment: RES_0603_1%_100PPM_4.7K)
T34  BC847C  [SOT23_3L_ReflowSoldering]
Title_new#12  DNI  (value not drawn)  (graphical)

### Ports
CU_K1 (bidir), PH_ALIM (bidir), PH_ALIM_NC2 (bidir), UC_CUMULUS (in)

### Nets
+15VSP: D46.3 K2.A1
GND: T34.2(E)
CU_K1: K2.14(NO) ; port CU_K1
PH_ALIM: F2.2 ; port PH_ALIM
PH_ALIM_NC2: K2.12(NC) ; port PH_ALIM_NC2
UC_CUMULUS: R176.1 ; port UC_CUMULUS
NetD46_1: D46.1 D46.2 K2.A2 T34.3(C)
NetF2_1: F2.1 K2.11(COM)
NetR176_2: R176.2 T34.1(B)

### Layout directives
net class BT: (no net found under the mark)
net class PH_BT: NetF2_1, PH_ALIM_NC2

### Notes on the sheet
- (near F2) 230Veff circuit, 5.5mm isolation needed
- Commande Cumulus
- ! : attention à l'isolation de la pin 12 à prendre en compte aussi
- Ce net ne va nulle part, il a été mis pour gérer les isolements correctement dans la CAO
- Cumulus
- (in symbol Title_new) Sheet Size:; Carte Boîtier Principal; A3; Print Date:; [No Variations]; Page:; /; EDA: ALtium Desingner 16; Rev. D

### Library data of the parts
D46 = BAT54C: as D48 on sheet SDEC944-xD_Fil_Pilote_1-2_(commun); Verification: LJ (14/05/02); ComponentLink1URL: O:\_Documentation\Datasheets\NXP\BAT54_series.pdf; ComponentLink2URL: o:\_Documentation\Datasheets\_BOITIERS\ACTIF_CMS\SOT\SOT_23_3P_(Schneider).PDF; Config: *; ComponentLink1Description: Datasheet; ComponentLink2Description: Datasheet Boitier; Ref Fab: BAT54C; Supplier 1: Farnell; Supplier Part Number 1: 1081192; Value: BAT54C
F2 = FUSIBLE_UMT250_0.315A_T: as F4 on sheet SDEC944-xD_Machines_laver_2-2_(commande); Config: *; ComponentLink1Description: Datasheet; ComponentLink1URL: O:\_Documentation\Datasheets\Schurter\Fusibles_CMS_UMT_250.pdf; ComponentLink2Description: Datasheet Boitier; ComponentLink2URL: o:\_Documentation\Datasheets\Littelfuse\449.pdf; Supplier 1: Mouser; Supplier Part Number 1: 693-3403.0161.11; Supplier 2: Farnell; Supplier Part Number 2: 1221084
K2 = RELAY_12VDC_1RT_32.21: as K5 on sheet SDEC944-xD_Machines_laver_2-2_(commande); ComponentLink1URL: O:\_Documentation\Datasheets\Finder\Relais_Serie_32.pdf; ComponentLink2URL: o:\_Documentation\Datasheets\Finder\; Config: *; ComponentLink1Description: Datasheet; ComponentLink2Description: Datasheet Boitier; Supplier 1: Farnell; Supplier Part Number 1: 1329652
R176 = RES_0603_1%_100PPM_4.7K: as R101 on sheet SDEC944-xD_Fil_Pilote_1-2_(commun); Verification: *; ComponentLink1URL: O:\_Documentation\Datasheets\Vishay\Resistances_D-CRCWe3.pdf; ComponentLink2URL: o:\_Documentation\Datasheets\_BOITIERS\PASSIF_CMS\; Config: *; ComponentLink1Description: Datasheet; ComponentLink2Description: Datasheet Boitier; Supplier 1: Farnell; Supplier 2: RadioSpares; Supplier Part Number 1: 1469807; Supplier Part Number 2: 6790484
T34 = BC847C: as T64 on sheet SDEC944-xD_Fil_Pilote_1-2_(commun); Ref Fab: BC847C; ComponentLink1URL: O:\_Documentation\Datasheets\NXP\BC847.pdf; ComponentLink2URL: o:\_Documentation\Datasheets\_BOITIERS\ACTIF_CMS\SOT\SOT_23_3P_(Schneider).PDF; Config: *; ComponentLink1Description: Datasheet; Value: BC847C; Supplier 1: Farnell; Supplier Part Number 1: 1081235; ComponentLink2Description: Datasheet Boitier
Title_new#12 = Title_new

## Sheet SDEC944-xD_Porte_tableau_domotique_(ouverture).SchDoc: Porte Tableau Domotique (ouverture)
size 393 x 270 mm; CompanyName: Seccom; Address1: 521, rue du capt. François Garbit; Address2: 69440 Mornant; Address3: seccom@seccom.fr; Address4: www.seccom.fr; DocumentNumber: 21; SheetNumber: 21; SheetTotal: 22; PageSetup: Record=PageOptions|CenterHorizontal=True|CenterVertical=True|PrintScale=0.74|XCorrection=1.00|YCorrection=1.00|PrintKind=0|BorderSize=5000000|LeftOffset=0|BottomOffset=0|Orientation=2|PaperLength=1000|PaperWidth=1000|Scale=100|PaperSource=7|PrintQuality=-4|MediaType=1|DitherType=10|PaperKind=A4|PrintScaleMode=1
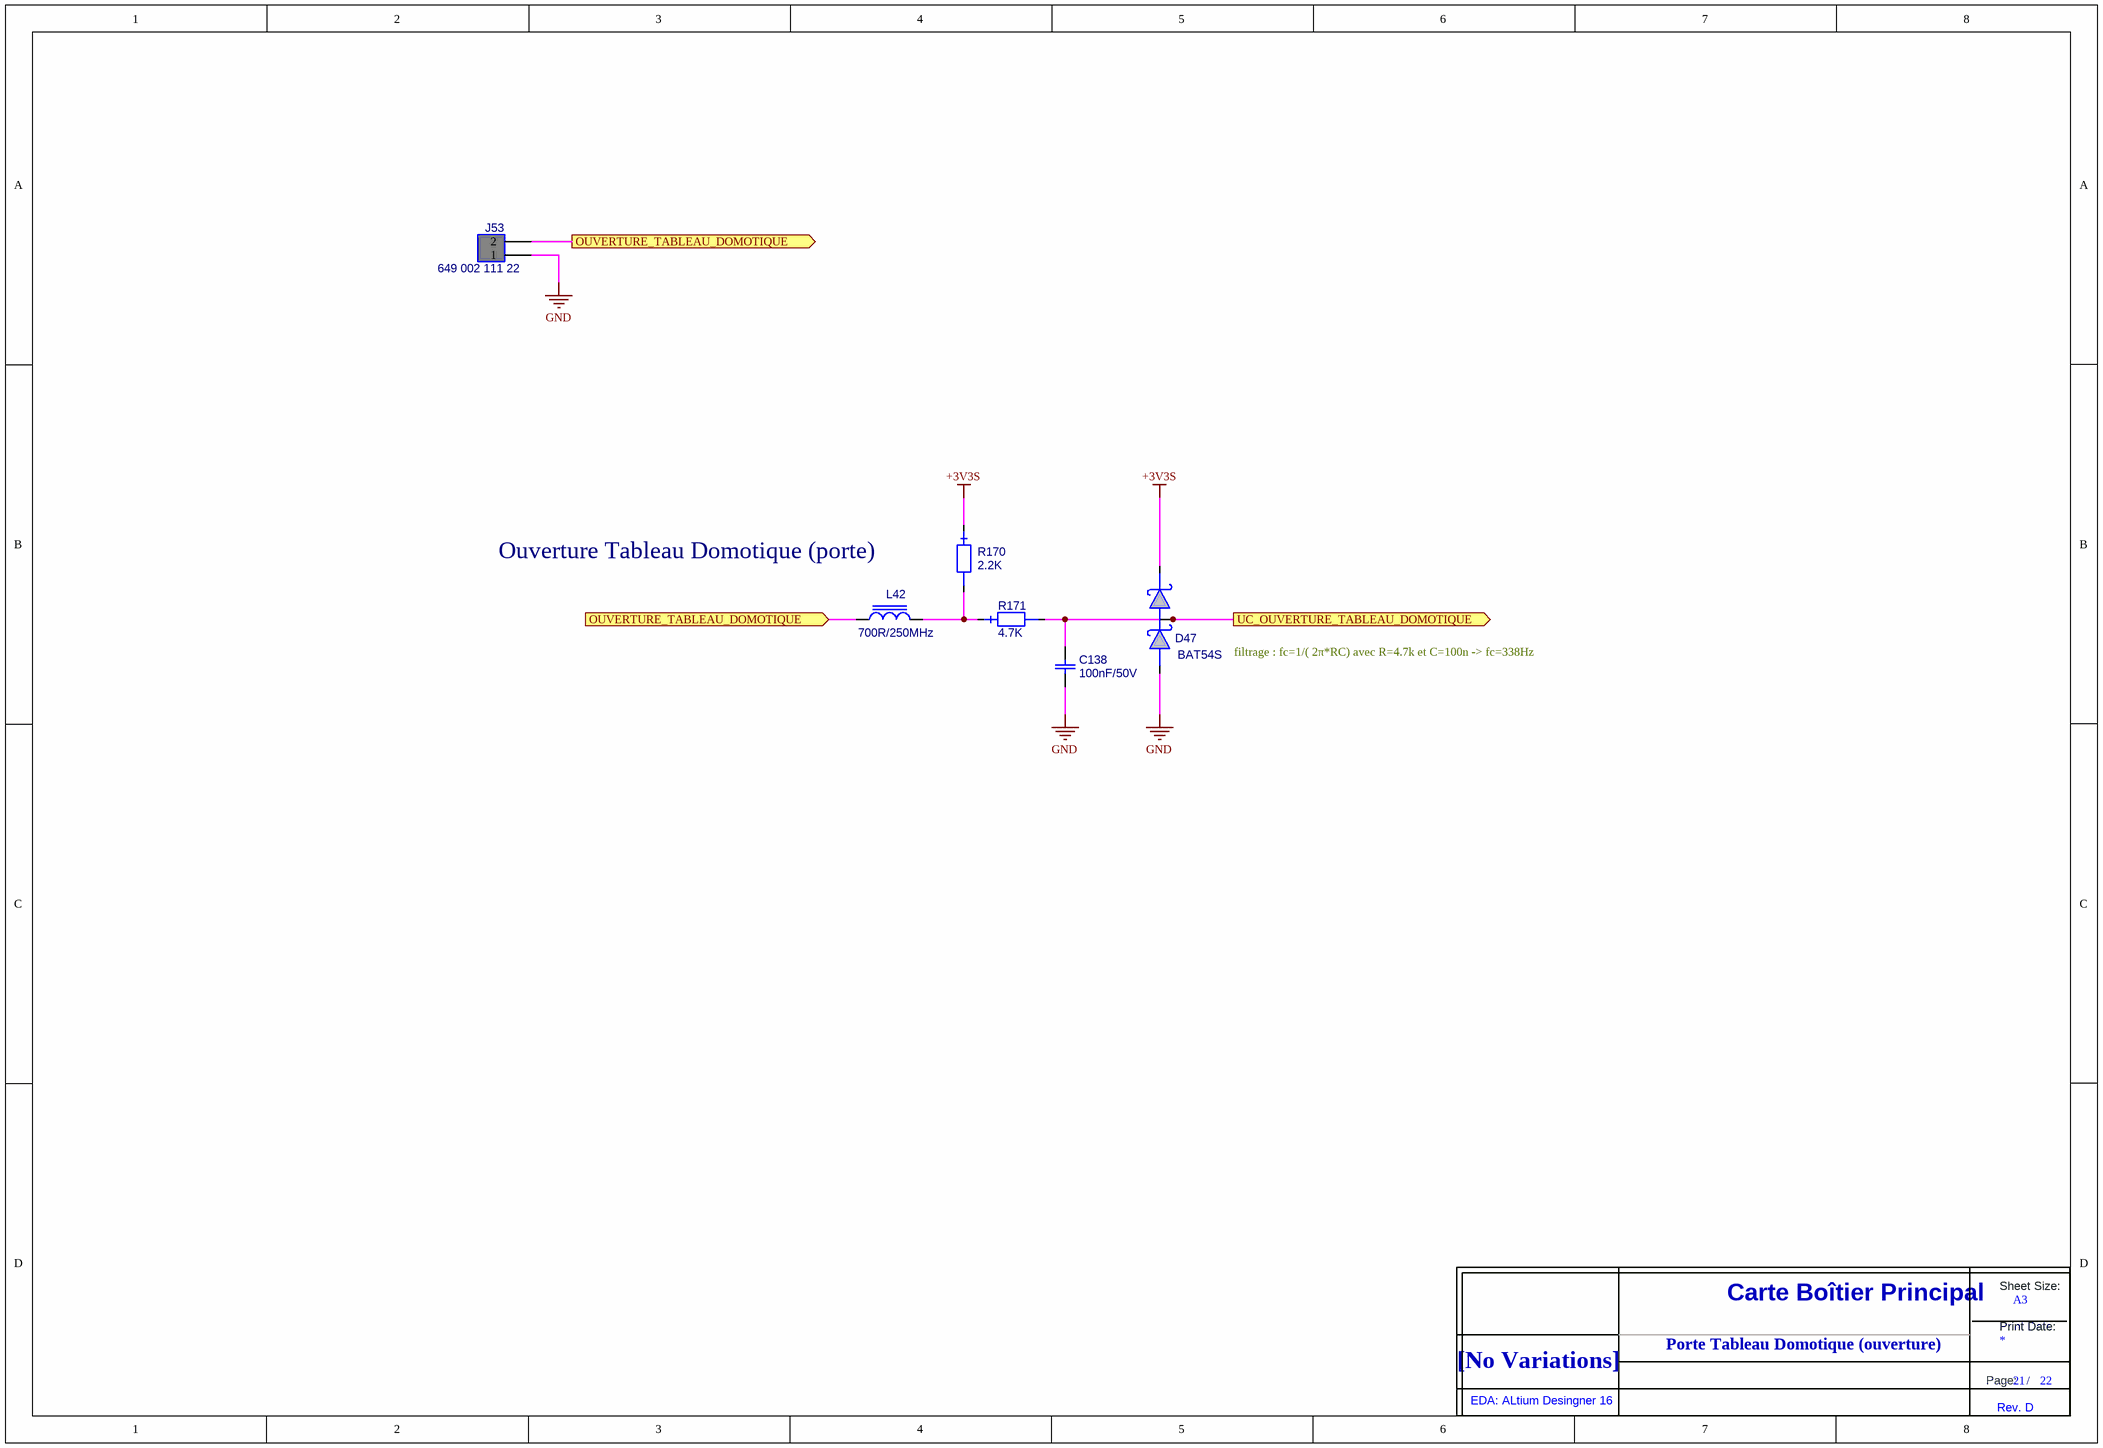
[diagram p12: SDEC944-xD_Porte_tableau_domotique_(ouverture).SchDoc]

### Parts
(Parts that share a designator on the sheet are numbered #1, #2 ... from top to bottom, then left to right.)
C138  value 100nF/50V  [0603_ReflowSoldering_CAP]  (hidden comment: C_0603_X7R_10%_100N-50V)
D47  BAT54S  [SOT23_3L_ReflowSoldering]
J53  value 649 002 111 22  [WR_MPC4_1X02D_Oval_Pad]  (hidden comment: EMB_4.20_M_D_1X02_Oval_PAD)
L42  value 700R/250MHz  [0603_ReflowSoldering_CAP]  (hidden comment: IND_FERRITE_0603_742792643)
R170  value 2.2K  [0603_ReflowSoldering_RES]  (hidden comment: RES_0603_1%_100PPM_2.2K)
R171  value 4.7K  [0603_ReflowSoldering_RES]  (hidden comment: RES_0603_1%_100PPM_4.7K)
Title_new#13  DNI  (value not drawn)  (graphical)

### Ports
OUVERTURE_TABLEAU_DOMOTIQUE (in), OUVERTURE_TABLEAU_DOMOTIQUE (out), UC_OUVERTURE_TABLEAU_DOMOTIQUE (out)

### Nets
+3V3S: D47.2 R170.1
GND: C138.2 D47.1 J53.1
OUVERTURE_TABLEAU_DOMOTIQUE: J53.2 L42.1 ; port OUVERTURE_TABLEAU_DOMOTIQUE
UC_OUVERTURE_TABLEAU_DOMOTIQUE: C138.1 D47.3 R171.2 ; port UC_OUVERTURE_TABLEAU_DOMOTIQUE
NetL42_2: L42.2 R170.2 R171.1

### Notes on the sheet
- Ouverture Tableau Domotique (porte)
- filtrage : fc=1/( 2π*RC) avec R=4.7k et C=100n -> fc=338Hz
- Porte Tableau Domotique (ouverture)
- (in symbol Title_new) Sheet Size:; Carte Boîtier Principal; A3; Print Date:; [No Variations]; Page:; /; EDA: ALtium Desingner 16; Rev. D

### Library data of the parts
C138 = C_0603_X7R_10%_100N-50V: as C4 on sheet SDEC944-xD_Fil_Pilote_1-2_(commun); ComponentLink1URL: O:\_Documentation\Datasheets\Kemet\Condos_Ceramic_CMS.pdf; ComponentLink2URL: o:\_Documentation\Datasheets\_BOITIERS\PASSIF_CMS\; Config: *; ComponentLink1Description: Datasheet; ComponentLink2Description: Datasheet Boitier; Supplier 1: Farnell; Supplier Part Number 1: 1288255
D47 = BAT54S: Diode Schottky double, BAT54 en série, Vrrm=30V, If=200mA, Vf=0.4Vmax, CMS; Creation: JMP 05/09/2002; Verification: GO (26/09/02); Reference: 000206/00; Boitier: SOT23_3L; Remarque: {Remarque}; Coeff: 1; Fabricant: NXP; ComponentLink1URL: O:\_Documentation\Datasheets\NXP\BAT54_series.pdf; ComponentLink2URL: o:\_Documentation\Datasheets\_BOITIERS\ACTIF_CMS\SOT\SOT_23_3P_(Schneider).PDF; Config: *; ComponentLink1Description: Datasheet; ComponentLink2Description: Datasheet Boitier; Ref Fab: BAT54S; Supplier 1: Farnell; Supplier Part Number 1: 1081194; Value: BAT54S; Supplier 2: Mouser; Supplier Part Number 2: 771-BAT54S-T/R
J53 = EMB_4.20_M_D_1X02_Oval_PAD: Connecteur Wurth, pas 4.2mm, 1x2 picots, 9A, 600V; Creation: ZA (04/10/12); Boitier: 9.6x5.4_h12.8mm; Coeff: 1; Fabricant: Wurth Electronik; Ref Fab: 64900211122; ComponentLink1URL: O:\_Documentation\Datasheets\Wurth_Elektronik\6490xx11122.pdf; Config: *; ComponentLink1Description: Datasheet; ComponentLink2Description: Datasheet Boitier; Supplier 1: Farnell; Supplier Part Number 1: 2113396
L42 = IND_FERRITE_0603_742792643: as L12 on sheet SDEC944-xD_Fil_Pilote_1-2_(commun); ComponentLink1URL: o:\_Documentation\Datasheets\Murata\Ferrite_BLM21P.pdf; Config: *; ComponentLink1Description: Datasheet; ComponentLink2Description: Datasheet Boitier; Ref Fab: 742792643; Supplier 1: Farnell; Supplier Part Number 1: 1800349
R170 = RES_0603_1%_100PPM_2.2K: Résistance, 0.100W, 1%, 100ppm, 75V, 2.2K; Creation: JPL (05/07/12); Boitier: 0603; Remarque: {Remarque}; Fabricant: Vishay; Ref Fab: CRCW06032K20FKEA; Coeff: 1; Verification: *; ComponentLink1URL: O:\_Documentation\Datasheets\Vishay\Resistances_D-CRCWe3.pdf; ComponentLink2URL: o:\_Documentation\Datasheets\_BOITIERS\PASSIF_CMS\; Config: *; ComponentLink1Description: Datasheet; ComponentLink2Description: Datasheet Boitier; Supplier 1: Farnell; Supplier 2: RadioSpares; Supplier Part Number 1: 1469765; Supplier Part Number 2: 6790112
R171 = RES_0603_1%_100PPM_4.7K: as R101 on sheet SDEC944-xD_Fil_Pilote_1-2_(commun); Verification: *; ComponentLink1URL: O:\_Documentation\Datasheets\Vishay\Resistances_D-CRCWe3.pdf; ComponentLink2URL: o:\_Documentation\Datasheets\_BOITIERS\PASSIF_CMS\; Config: *; ComponentLink1Description: Datasheet; ComponentLink2Description: Datasheet Boitier; Supplier 1: Farnell; Supplier 2: RadioSpares; Supplier Part Number 1: 1469807; Supplier Part Number 2: 6790484
Title_new#13 = Title_new

## Sheet SDEC944-xD_Borniers.SchDoc: Borniers
size 393 x 270 mm; CompanyName: Seccom; Address1: 521, rue du capt. François Garbit; Address2: 69440 Mornant; Address3: seccom@seccom.fr; Address4: www.seccom.fr; DocumentNumber: 22; SheetNumber: 22; SheetTotal: 22; PageSetup: Record=PageOptions|CenterHorizontal=True|CenterVertical=True|PrintScale=0.74|XCorrection=1.00|YCorrection=1.00|PrintKind=0|BorderSize=5000000|LeftOffset=0|BottomOffset=0|Orientation=2|PaperLength=1000|PaperWidth=1000|Scale=100|PaperSource=7|PrintQuality=-4|MediaType=1|DitherType=10|PaperKind=A4|PrintScaleMode=1
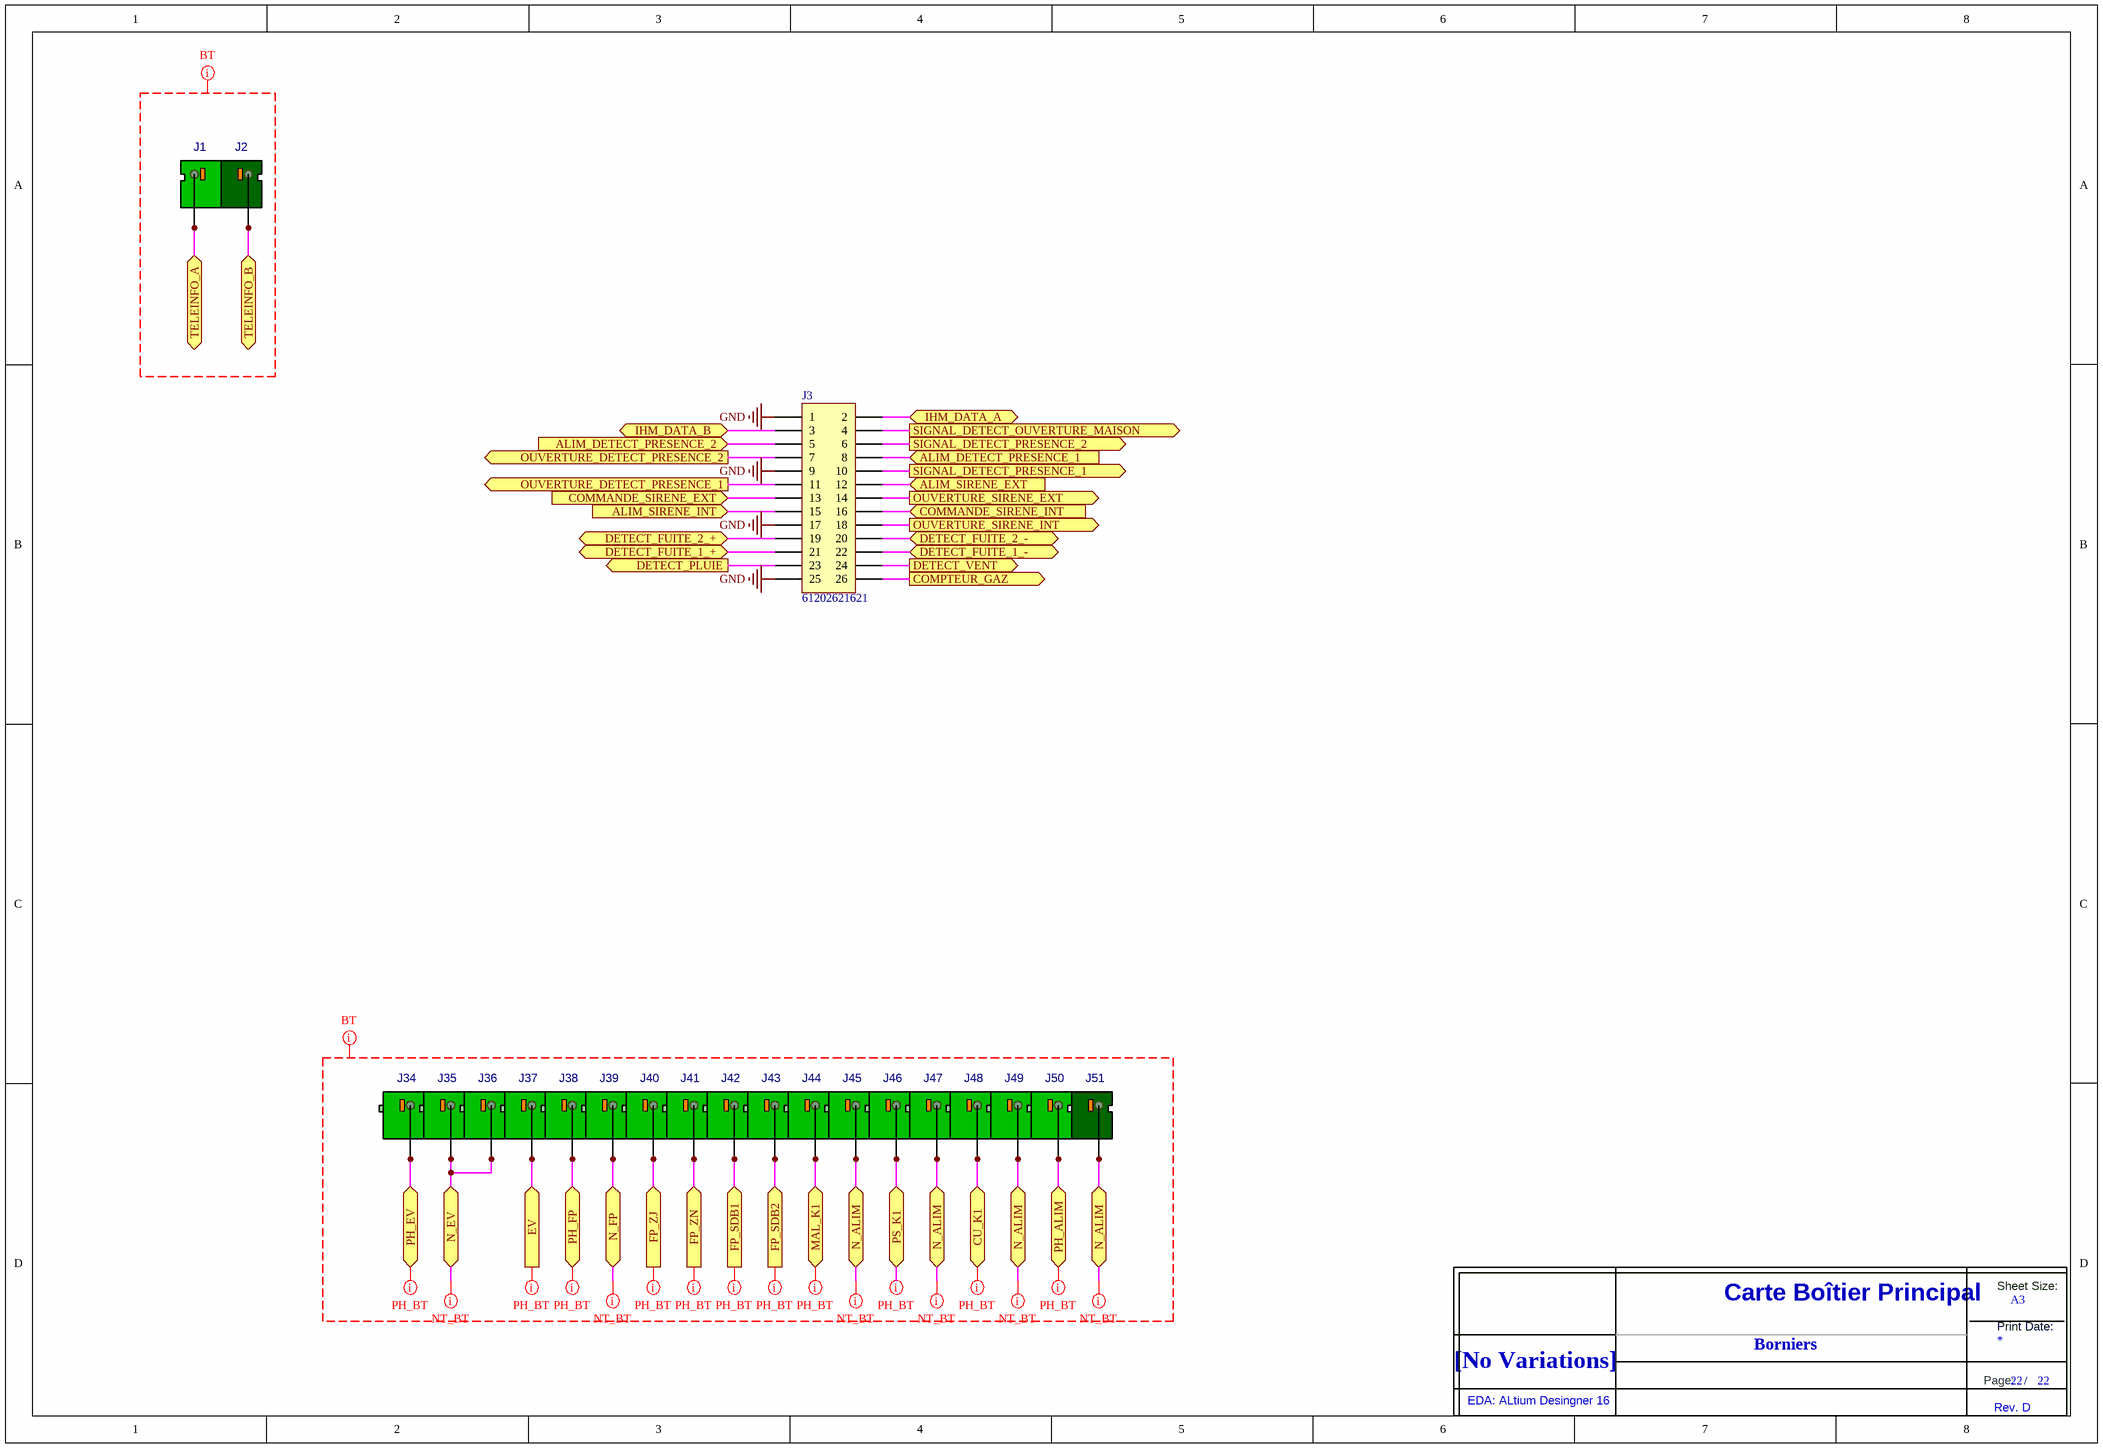
[diagram p13: SDEC944-xD_Borniers.SchDoc]

### Parts
(Parts that share a designator on the sheet are numbered #1, #2 ... from top to bottom, then left to right.)
J1  BRESS_CI_D_7.62_01_FFKDSA/V2  [BRESS_FFKDSA/V2-7,62_P1.3]  (value not drawn)
J2  BRESS_CI_D_7.62_01_FFKDSA1/V2  [BRESS_FFKDSA1/V2-7,62_P1.3]  (value not drawn)
J3  61202621621  [IDC2p54_26P]
J34  BRESS_CI_D_7.62_01_FFKDSA/V2  [BRESS_FFKDSA/V2-7,62_P1.3]  (value not drawn)
J35  BRESS_CI_D_7.62_01_FFKDSA/V2  [BRESS_FFKDSA/V2-7,62_P1.3]  (value not drawn)
J36  BRESS_CI_D_7.62_01_FFKDSA/V2  [BRESS_FFKDSA/V2-7,62_P1.3]  (value not drawn)
J37  BRESS_CI_D_7.62_01_FFKDSA/V2  [BRESS_FFKDSA/V2-7,62_P1.3]  (value not drawn)
J38  BRESS_CI_D_7.62_01_FFKDSA/V2  [BRESS_FFKDSA/V2-7,62_P1.3]  (value not drawn)
J39  BRESS_CI_D_7.62_01_FFKDSA/V2  [BRESS_FFKDSA/V2-7,62_P1.3]  (value not drawn)
J40  BRESS_CI_D_7.62_01_FFKDSA/V2  [BRESS_FFKDSA/V2-7,62_P1.3]  (value not drawn)
J41  BRESS_CI_D_7.62_01_FFKDSA/V2  [BRESS_FFKDSA/V2-7,62_P1.3]  (value not drawn)
J42  BRESS_CI_D_7.62_01_FFKDSA/V2  [BRESS_FFKDSA/V2-7,62_P1.3]  (value not drawn)
J43  BRESS_CI_D_7.62_01_FFKDSA/V2  [BRESS_FFKDSA/V2-7,62_P1.3]  (value not drawn)
J44  BRESS_CI_D_7.62_01_FFKDSA/V2  [BRESS_FFKDSA/V2-7,62_P1.3]  (value not drawn)
J45  BRESS_CI_D_7.62_01_FFKDSA/V2  [BRESS_FFKDSA/V2-7,62_P1.3]  (value not drawn)
J46  BRESS_CI_D_7.62_01_FFKDSA/V2  [BRESS_FFKDSA/V2-7,62_P1.3]  (value not drawn)
J47  BRESS_CI_D_7.62_01_FFKDSA/V2  [BRESS_FFKDSA/V2-7,62_P1.3]  (value not drawn)
J48  BRESS_CI_D_7.62_01_FFKDSA/V2  [BRESS_FFKDSA/V2-7,62_P1.3]  (value not drawn)
J49  BRESS_CI_D_7.62_01_FFKDSA/V2  [BRESS_FFKDSA/V2-7,62_P1.3]  (value not drawn)
J50  BRESS_CI_D_7.62_01_FFKDSA/V2  [BRESS_FFKDSA/V2-7,62_P1.3]  (value not drawn)
J51  BRESS_CI_D_7.62_01_FFKDSA1/V2  [BRESS_FFKDSA1/V2-7,62_P1.3]  (value not drawn)
Title_new#14  DNI  (value not drawn)  (graphical)

### Ports
ALIM_DETECT_PRESENCE_1 (in), ALIM_DETECT_PRESENCE_2 (in), ALIM_SIRENE_EXT (in), ALIM_SIRENE_INT (in), COMMANDE_SIRENE_EXT (in), COMMANDE_SIRENE_INT (in), COMPTEUR_GAZ (out), CU_K1 (bidir), DETECT_FUITE_1_+ (bidir), DETECT_FUITE_1_- (bidir), DETECT_FUITE_2_+ (bidir), DETECT_FUITE_2_- (bidir), DETECT_PLUIE (out), DETECT_VENT (out), EV (in), FP_SDB1 (in), FP_SDB2 (in), FP_ZJ (in), FP_ZN (in), IHM_DATA_A (bidir), IHM_DATA_B (bidir), MAL_K1 (bidir), N_ALIM (bidir), N_EV (bidir), N_FP, OUVERTURE_DETECT_PRESENCE_1 (out), OUVERTURE_DETECT_PRESENCE_2 (out), OUVERTURE_SIRENE_EXT (out), OUVERTURE_SIRENE_INT (out), PH_ALIM (bidir), PH_EV (bidir), PH_FP, PS_K1 (bidir), SIGNAL_DETECT_OUVERTURE_MAISON (out), SIGNAL_DETECT_PRESENCE_1 (out), SIGNAL_DETECT_PRESENCE_2 (out), TELEINFO_A (bidir), TELEINFO_B (bidir)

### Nets
+12VISOFP: J38.1 J38.2 ; port PH_FP
GND: J3.1 J3.9 J3.17 J3.25
ALIM_DETECT_PRESENCE_1: J3.8 ; port ALIM_DETECT_PRESENCE_1
ALIM_DETECT_PRESENCE_2: J3.5 ; port ALIM_DETECT_PRESENCE_2
ALIM_SIRENE_EXT: J3.12 ; port ALIM_SIRENE_EXT
ALIM_SIRENE_INT: J3.15 ; port ALIM_SIRENE_INT
COMMANDE_SIRENE_EXT: J3.13 ; port COMMANDE_SIRENE_EXT
COMMANDE_SIRENE_INT: J3.16 ; port COMMANDE_SIRENE_INT
COMPTEUR_GAZ: J3.26 ; port COMPTEUR_GAZ
CU_K1: J48.1 J48.2 ; port CU_K1
DETECT_FUITE_1_+: J3.21 ; port DETECT_FUITE_1_+
DETECT_FUITE_1_-: J3.22 ; port DETECT_FUITE_1_-
DETECT_FUITE_2_+: J3.19 ; port DETECT_FUITE_2_+
DETECT_FUITE_2_-: J3.20 ; port DETECT_FUITE_2_-
DETECT_PLUIE: J3.23 ; port DETECT_PLUIE
DETECT_VENT: J3.24 ; port DETECT_VENT
EV: J37.1 J37.2 ; port EV
FP_SDB1: J42.1 J42.2 ; port FP_SDB1
FP_SDB2: J43.1 J43.2 ; port FP_SDB2
FP_ZJ: J40.1 J40.2 ; port FP_ZJ
FP_ZN: J41.1 J41.2 ; port FP_ZN
IHM_DATA_A: J3.2 ; port IHM_DATA_A
IHM_DATA_B: J3.3 ; port IHM_DATA_B
MAL_K1: J44.1 J44.2 ; port MAL_K1
N_ALIM: J45.1 J45.2 J47.1 J47.2 J49.1 J49.2 J51.1 J51.2 ; port N_ALIM
N_EV: J35.1 J35.2 J36.1 J36.2 ; port N_EV
N_FP: J39.1 J39.2 ; port N_FP
OUVERTURE_DETECT_PRESENCE_1: J3.11 ; port OUVERTURE_DETECT_PRESENCE_1
OUVERTURE_DETECT_PRESENCE_2: J3.7 ; port OUVERTURE_DETECT_PRESENCE_2
OUVERTURE_SIRENE_EXT: J3.14 ; port OUVERTURE_SIRENE_EXT
OUVERTURE_SIRENE_INT: J3.18 ; port OUVERTURE_SIRENE_INT
PH_ALIM: J50.1 J50.2 ; port PH_ALIM
PH_EV: J34.1 J34.2 ; port PH_EV
PS_K1: J46.1 J46.2 ; port PS_K1
SIGNAL_DETECT_OUVERTURE_MAISON: J3.4 ; port SIGNAL_DETECT_OUVERTURE_MAISON
SIGNAL_DETECT_PRESENCE_1: J3.10 ; port SIGNAL_DETECT_PRESENCE_1
SIGNAL_DETECT_PRESENCE_2: J3.6 ; port SIGNAL_DETECT_PRESENCE_2
TELEINFO_A: J1.1 J1.2 ; port TELEINFO_A
TELEINFO_B: J2.1 J2.2 ; port TELEINFO_B

### Layout directives
net class BT: (no net found under the mark)
net class PH_BT: +12VISOFP, CU_K1, EV, FP_SDB1, FP_SDB2, FP_ZJ, FP_ZN, MAL_K1, PH_ALIM, PH_EV, PS_K1
net class NT_BT: N_ALIM, N_EV, N_FP

### Notes on the sheet
- Borniers
- (in symbol Title_new) Sheet Size:; Carte Boîtier Principal; A3; Print Date:; [No Variations]; Page:; /; EDA: ALtium Desingner 16; Rev. D

### Library data of the parts
J1 J34-J50 = BRESS_CI_D_7.62_01_FFKDSA/V2: Bornier à connexion par ressorts/déconnexion par levier, série FFKDSA/V2, e7.62, 1x1pts, droit, juxtaposable, 500V/17.5A, AWG22~16, Vert/Orange; Creation: LJ (21/11/11); Boitier: 7.62x10_h15.8_e7.62_p1.3mm; Remarque: {Remarque}; Fabricant: Phoenix Contact; Ref Fab: 1790377; Coeff: 1; Value: FFKDSA/V2-7,62; Verification: *; ComponentLink1URL: o:\_Documentation\Datasheets\Phoenix\FFKDSA-V2_7,62_1790377.pdf; ComponentLink2URL: o:\_Documentation\Datasheets\_BOITIERS\; Config: *; ComponentLink1Description: Datasheet; ComponentLink2Description: Datasheet
J2 J51 = BRESS_CI_D_7.62_01_FFKDSA1/V2: Bornier à connexion par ressorts/déconnexion par levier, série FFKDSA1/V2, e7.62, 1x1pts, droit, juxtaposable, 500V/17.5A, AWG22~16, Vert/Orange; Creation: LJ (21/11/11); Boitier: 7.62x10_h15.8_e7.62_p1.3mm; Remarque: {Remarque}; Fabricant: Phoenix Contact; Ref Fab: 1790487; Coeff: 1; Value: FFKDSA1/V2-7,62; Verification: *; ComponentLink1URL: o:\_Documentation\Datasheets\Phoenix\FFKDSA1-V2_7,62_1790487.pdf; ComponentLink2URL: o:\_Documentation\Datasheets\_BOITIERS\; Config: *; ComponentLink1Description: Datasheet; ComponentLink2Description: Datasheet
J3 = Header 13X2: 26 Positions Header, Shrouded Connector 0.100" (2.54mm) Through Hole Gold; Manufacturer: Wurth Electronics Inc; Supplier 1: Digi-Key; Supplier Part Number 1: 732-2097-ND; Manufacturer Part Number: 61202621621; Fabricant: Wurth Electronics Inc; Ref Fab: 61202621621; Value: 61202621621
Title_new#14 = Title_new

## Nets that join several sheets
+3V3S: SDEC944-xD_Alimentation_1-2 (D30.2 D43.2), SDEC944-xD_Alimentation_2-2 (6 pins), SDEC944-xD_Coeur (12 pins), SDEC944-xD_Ethernet (8 pins), SDEC944-xD_Liaison_IHM (11 pins), SDEC944-xD_Arrosage_(detect_pluie+commande_vanne) (D16.2 R54.1), SDEC944-xD_Fil_Pilote_1-2_(commun) (R5.2 R27.2), SDEC944-xD_Porte_tableau_domotique_(ouverture) (D47.2 R170.1)
+5VS: SDEC944-xD_Alimentation_2-2 (5 pins), SDEC944-xD_Coeur (R108.2), SDEC944-xD_Fil_Pilote_2-2_(zone_jour) (R87.1 R121.1 R137.1 R153.1)
+12VISOFP: SDEC944-xD_Fil_Pilote_1-2_(commun) (C30.2 JT48.1 L15.2 R20.1), SDEC944-xD_Fil_Pilote_2-2_(zone_jour) (8 pins), SDEC944-xD_Borniers (J38.1 J38.2)
+12VSP: SDEC944-xD_Alimentation_2-2 (5 pins), SDEC944-xD_Fil_Pilote_1-2_(commun) (C4.1 L12.1)
+15V: SDEC944-xD_Alimentation_1-2 (C52.2 D45.A L11.2), SDEC944-xD_Chargeur_Batterie (5 pins)
+15VS: SDEC944-xD_Alimentation_1-2 (D45.K T14.2), SDEC944-xD_Alimentation_2-2 (C103.1 L13.1 R115.2 T32.3), SDEC944-xD_Liaison_IHM (5 pins)
+15VSP: SDEC944-xD_Alimentation_2-2 (C97.1 C98.2 T32.2 U16.3), SDEC944-xD_Arrosage_(detect_pluie+commande_vanne) (D14.3 K3.A1), SDEC944-xD_Machines_laver_2-2_(commande) (D15.3 K5.A1), SDEC944-xD_Cumulus (D46.3 K2.A1)
GND: SDEC944-xD_Alimentation_1-2 (30 pins), SDEC944-xD_Alimentation_2-2 (20 pins), SDEC944-xD_Chargeur_Batterie (D58.1 R207.1 R208.1), SDEC944-xD_Coeur (47 pins), SDEC944-xD_Ethernet (23 pins), SDEC944-xD_Liaison_IHM (26 pins), SDEC944-xD_Arrosage_(detect_pluie+commande_vanne) (C59.2 D16.1 T28.2), SDEC944-xD_Fil_Pilote_1-2_(commun) (7 pins), SDEC944-xD_Fil_Pilote_2-2_(zone_jour) (T12.2 T15.2 T16.2 T18.2), SDEC944-xD_Machines_laver_2-2_(commande) (T23.2), SDEC944-xD_Cumulus (T34.2), SDEC944-xD_Porte_tableau_domotique_(ouverture) (C138.2 D47.1 J53.1), SDEC944-xD_Borniers (J3.1 J3.9 J3.17 J3.25)
GNDISOFP: SDEC944-xD_Fil_Pilote_1-2_(commun) (C30.1 JT49.1 L16.2), SDEC944-xD_Fil_Pilote_2-2_(zone_jour) (8 pins)
CU_K1: SDEC944-xD_Cumulus (K2.14), SDEC944-xD_Borniers (J48.1 J48.2)
DETECT_PLUIE: SDEC944-xD_Arrosage_(detect_pluie+commande_vanne) (L26.1), SDEC944-xD_Borniers (J3.23)
EV: SDEC944-xD_Arrosage_(detect_pluie+commande_vanne) (K3.14), SDEC944-xD_Borniers (J37.1 J37.2)
FP_SDB1: SDEC944-xD_Fil_Pilote_2-2_(zone_jour) (F8.2), SDEC944-xD_Borniers (J42.1 J42.2)
FP_SDB2: SDEC944-xD_Fil_Pilote_2-2_(zone_jour) (F9.2), SDEC944-xD_Borniers (J43.1 J43.2)
FP_ZJ: SDEC944-xD_Fil_Pilote_2-2_(zone_jour) (F6.2), SDEC944-xD_Borniers (J40.1 J40.2)
FP_ZN: SDEC944-xD_Fil_Pilote_2-2_(zone_jour) (F7.2), SDEC944-xD_Borniers (J41.1 J41.2)
IHM_DATA_A: SDEC944-xD_Liaison_IHM (D8.K L2.3), SDEC944-xD_Borniers (J3.2)
IHM_DATA_B: SDEC944-xD_Liaison_IHM (D63.K L2.4), SDEC944-xD_Borniers (J3.3)
MAL_K1: SDEC944-xD_Machines_laver_2-2_(commande) (K5.14), SDEC944-xD_Borniers (J44.1 J44.2)
N_ALIM: SDEC944-xD_Alimentation_1-2 (C99.2 L37.1 L38.1 VR1.1), SDEC944-xD_Borniers (8 pins)
N_FP: SDEC944-xD_Fil_Pilote_1-2_(commun) (R19.1), SDEC944-xD_Borniers (J39.1 J39.2)
PH_ALIM: SDEC944-xD_Alimentation_1-2 (F3.1), SDEC944-xD_Machines_laver_2-2_(commande) (F4.2), SDEC944-xD_Cumulus (F2.2), SDEC944-xD_Borniers (J50.1 J50.2)
PH_EV: SDEC944-xD_Arrosage_(detect_pluie+commande_vanne) (K3.11), SDEC944-xD_Borniers (J34.1 J34.2)
UC_24V_MON: SDEC944-xD_Alimentation_1-2 (D30.3 R56.1 R65.2), SDEC944-xD_Coeur (JT28.1 U10.66)
UC_+15VSP: SDEC944-xD_Alimentation_2-2 (R160.2), SDEC944-xD_Coeur (JT23.1 U10.55)
UC_BATT_CTRL: SDEC944-xD_Alimentation_1-2 (R13.1 R64.1), SDEC944-xD_Coeur (JT24.1 U10.56)
UC_CUMULUS: SDEC944-xD_Coeur (JT34.1 U10.84), SDEC944-xD_Cumulus (R176.1)
UC_DETECT_PLUIE: SDEC944-xD_Coeur (JT37.1 U10.87), SDEC944-xD_Arrosage_(detect_pluie+commande_vanne) (C59.1 D16.3 R55.2)
UC_EV: SDEC944-xD_Coeur (JT36.1 U10.86), SDEC944-xD_Arrosage_(detect_pluie+commande_vanne) (R39.1)
UC_FEC_COL: SDEC944-xD_Coeur (U10.109), SDEC944-xD_Ethernet (U13.42)
UC_FEC_CRS: SDEC944-xD_Coeur (U10.108), SDEC944-xD_Ethernet (RR3.5)
UC_FEC_MDC: SDEC944-xD_Coeur (U10.128), SDEC944-xD_Ethernet (U13.31)
UC_FEC_MDIO: SDEC944-xD_Coeur (U10.129), SDEC944-xD_Ethernet (R73.1 U13.30)
UC_FEC_RXCLK: SDEC944-xD_Coeur (U10.120), SDEC944-xD_Ethernet (RR3.1)
UC_FEC_RXD0: SDEC944-xD_Coeur (U10.122), SDEC944-xD_Ethernet (RR2.7)
UC_FEC_RXD1: SDEC944-xD_Coeur (U10.123), SDEC944-xD_Ethernet (RR2.5)
UC_FEC_RXD2: SDEC944-xD_Coeur (U10.126), SDEC944-xD_Ethernet (RR2.3)
UC_FEC_RXD3: SDEC944-xD_Coeur (U10.127), SDEC944-xD_Ethernet (RR2.1)
UC_FEC_RXDV: SDEC944-xD_Coeur (U10.121), SDEC944-xD_Ethernet (RR3.3)
UC_FEC_RXER: SDEC944-xD_Coeur (U10.119), SDEC944-xD_Ethernet (RR3.7)
UC_FEC_TXCLK: SDEC944-xD_Coeur (U10.117), SDEC944-xD_Ethernet (R75.1)
UC_FEC_TXD0: SDEC944-xD_Coeur (RR1.1), SDEC944-xD_Ethernet (U13.3)
UC_FEC_TXD1: SDEC944-xD_Coeur (RR1.3), SDEC944-xD_Ethernet (U13.4)
UC_FEC_TXD2: SDEC944-xD_Coeur (RR1.5), SDEC944-xD_Ethernet (U13.5)
UC_FEC_TXD3: SDEC944-xD_Coeur (RR1.7), SDEC944-xD_Ethernet (U13.6)
UC_FEC_TXEN: SDEC944-xD_Coeur (R47.2), SDEC944-xD_Ethernet (U13.2)
UC_FLASH_CS: SDEC944-xD_Coeur (U10.23), SDEC944-xD_Ethernet (U28.1)
UC_FP_SDB1: SDEC944-xD_Coeur (JT39.1 U10.89), SDEC944-xD_Fil_Pilote_2-2_(zone_jour) (R51.1)
UC_FP_SDB2: SDEC944-xD_Coeur (JT38.1 U10.88), SDEC944-xD_Fil_Pilote_2-2_(zone_jour) (R57.1)
UC_FP_ZJ: SDEC944-xD_Coeur (JT41.1 U10.93), SDEC944-xD_Fil_Pilote_2-2_(zone_jour) (R32.1)
UC_FP_ZN: SDEC944-xD_Coeur (JT40.1 U10.90), SDEC944-xD_Fil_Pilote_2-2_(zone_jour) (R36.1)
UC_IHM_ERR: SDEC944-xD_Coeur (JT20.1 U10.32), SDEC944-xD_Liaison_IHM (R45.1 U1.1)
UC_IHM_POL_TX: SDEC944-xD_Coeur (JT15.1 U10.15), SDEC944-xD_Liaison_IHM (U5.6)
UC_IHM_RX: SDEC944-xD_Coeur (JT13.1 U10.17), SDEC944-xD_Liaison_IHM (U8.4)
UC_IHM_TX: SDEC944-xD_Coeur (JT14.1 U10.16), SDEC944-xD_Liaison_IHM (U5.1 U5.3)
UC_MACHINES_LAVER: SDEC944-xD_Coeur (JT35.1 U10.85), SDEC944-xD_Machines_laver_2-2_(commande) (R59.1)
UC_OUVERTURE_TABLEAU_DOMOTIQUE: SDEC944-xD_Coeur (JT29.1 U10.74), SDEC944-xD_Porte_tableau_domotique_(ouverture) (C138.1 D47.3 R171.2)
UC_~{RESET}: SDEC944-xD_Coeur (C120.2 J33.8 R106.1 U10.141), SDEC944-xD_Ethernet (R31.1)
UC_SECTEUR_SYNC: SDEC944-xD_Coeur (JT42.1 U10.96), SDEC944-xD_Fil_Pilote_1-2_(commun) (C12.2 C73.2 R101.2)
UC_SPI_CS: SDEC944-xD_Coeur (JT9.1 U10.27), SDEC944-xD_Ethernet (U9.5)
UC_SPI_MISO: SDEC944-xD_Coeur (JT6.1 U10.24), SDEC944-xD_Ethernet (U9.4 U28.2)
UC_SPI_MOSI: SDEC944-xD_Coeur (JT7.1 U10.25), SDEC944-xD_Ethernet (U9.3 U28.5)
UC_SPI_SCK: SDEC944-xD_Coeur (JT8.1 U10.26), SDEC944-xD_Ethernet (U9.1 U28.6)
UC_VBATT: SDEC944-xD_Alimentation_1-2 (D43.3 R61.1 R67.2), SDEC944-xD_Coeur (JT32.1 U10.77)
VBATT: SDEC944-xD_Alimentation_1-2 (D67.A F5.2 R61.2), SDEC944-xD_Chargeur_Batterie (D12.K R190.2 R202.2)

## Assembly variants
SC944-0C: not fitted C8 C79 C80 C92 D27 D55 J54 J102 L38 R109 R110 R188 R196